# EAGLE design base (EAGLE 9.6.2)

## Sheet 1 of 4
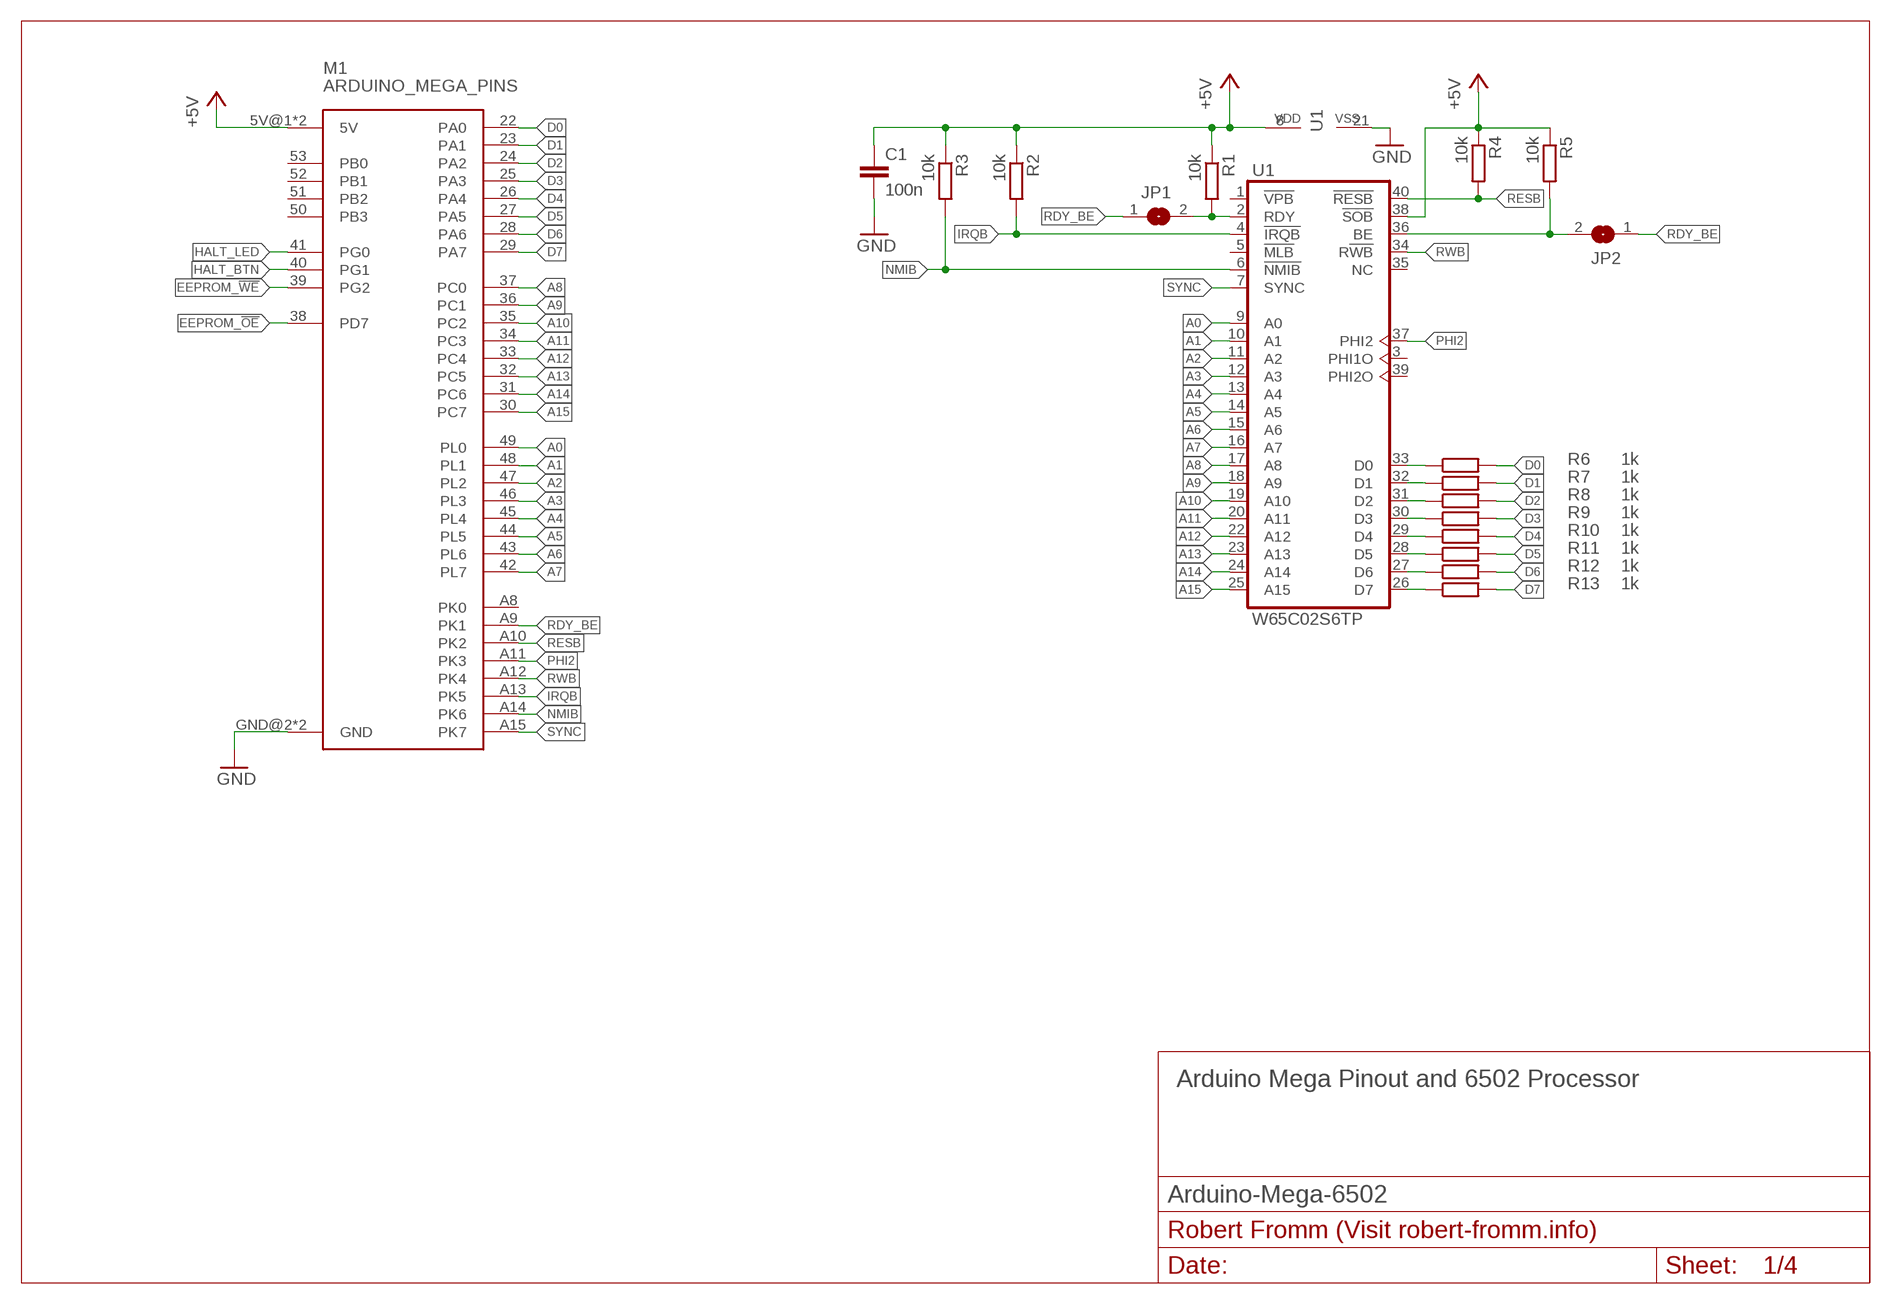
[diagram p0: schematic, sheet 1]

### Parts
C1  100n  C-EUC0805  [C0805]
JP1  SJ  [SJ]
JP2  SJ  [SJ]
M1  ARDUINO_MEGA_PINS  [ARDUINO_MEGA_PINS]
R1  10k  R-EU_R0805  [R0805]
R2  10k  R-EU_R0805  [R0805]
R3  10k  R-EU_R0805  [R0805]
R4  10k  R-EU_R0805  [R0805]
R5  10k  R-EU_R0805  [R0805]
R6  1k  R-EU_R0805  [R0805]
R7  1k  R-EU_R0805  [R0805]
R8  1k  R-EU_R0805  [R0805]
R9  1k  R-EU_R0805  [R0805]
R10  1k  R-EU_R0805  [R0805]
R11  1k  R-EU_R0805  [R0805]
R12  1k  R-EU_R0805  [R0805]
R13  1k  R-EU_R0805  [R0805]
U1  W65C02S6TP  [DIL40]

### Nets
+5V: C1.1 M1.5V@1(5V) M1.5V@2(5V) R1.1 R2.1 R3.1 R4.1 R5.1 U1.8(P:VDD) U1.38(1:!SOB) ; also sheet 2,3,4
A0: M1.49(PL0) U1.9(1:A0) ; also sheet 2,4
A1: M1.48(PL1) U1.10(1:A1) ; also sheet 2,4
A2: M1.47(PL2) U1.11(1:A2) ; also sheet 2,4
A3: M1.46(PL3) U1.12(1:A3) ; also sheet 2,4
A4: M1.45(PL4) U1.13(1:A4) ; also sheet 2,3,4
A5: M1.44(PL5) U1.14(1:A5) ; also sheet 2,3,4
A6: M1.43(PL6) U1.15(1:A6) ; also sheet 2,3,4
A7: M1.42(PL7) U1.16(1:A7) ; also sheet 2,4
A8: M1.37(PC0) U1.17(1:A8) ; also sheet 2,4
A9: M1.36(PC1) U1.18(1:A9) ; also sheet 2,4
A10: M1.35(PC2) U1.19(1:A10) ; also sheet 2,4
A11: M1.34(PC3) U1.20(1:A11) ; also sheet 2,4
A12: M1.33(PC4) U1.22(1:A12) ; also sheet 2,4
A13: M1.32(PC5) U1.23(1:A13) ; also sheet 2,4
A14: M1.31(PC6) U1.24(1:A14) ; also sheet 2,3,4
A15: M1.30(PC7) U1.25(1:A15) ; also sheet 3,4
BE: JP2.2 R5.2 U1.36(1:BE)
D0: M1.22(PA0) R6.2 ; also sheet 2,4
D1: M1.23(PA1) R7.2 ; also sheet 2,4
D2: M1.24(PA2) R8.2 ; also sheet 2,4
D3: M1.25(PA3) R9.2 ; also sheet 2,4
D4: M1.26(PA4) R10.2 ; also sheet 2,4
D5: M1.27(PA5) R11.2 ; also sheet 2,4
D6: M1.28(PA6) R12.2 ; also sheet 2,4
D7: M1.29(PA7) R13.2 ; also sheet 2,4
EEPROM_!OE: M1.38(PD7) ; also sheet 2
EEPROM_!WE: M1.39(PG2) ; also sheet 2
GND: C1.2 M1.GND@2(GND) M1.GND@3(GND) U1.21(P:VSS) ; also sheet 2,3,4
HALT_BTN: M1.40(PG1) ; also sheet 4
HALT_LED: M1.41(PG0) ; also sheet 4
IRQB: M1.A13(PK5) R2.2 U1.4(1:!IRQB) ; also sheet 2,4
N$1: R6.1 U1.33(1:D0)
N$2: R7.1 U1.32(1:D1)
N$3: R8.1 U1.31(1:D2)
N$4: R9.1 U1.30(1:D3)
N$5: R10.1 U1.29(1:D4)
N$6: R11.1 U1.28(1:D5)
N$7: R12.1 U1.27(1:D6)
N$8: R13.1 U1.26(1:D7)
NMIB: M1.A14(PK6) R3.2 U1.6(1:!NMIB)
PHI2: M1.A11(PK3) U1.37(1:PHI2) ; also sheet 2,3,4
RDY: JP1.2 R1.2 U1.2(1:RDY)
RDY_BE: JP1.1 JP2.1 M1.A9(PK1)
RESB: M1.A10(PK2) R4.2 U1.40(1:!RESB) ; also sheet 2,4
RWB: M1.A12(PK4) U1.34(1:R!WB) ; also sheet 2,4
SYNC: M1.A15(PK7) U1.7(1:SYNC) ; also sheet 4
Unconnected: M1.50(PB3) M1.51(PB2) M1.52(PB1) M1.53(PB0) M1.A8(PK0) U1.1(1:!VPB) U1.3(1:PHI1O) U1.5(1:!MLB) U1.35(1:NC) U1.39(1:PHI2O)

### Notes on the sheet
- Arduino Mega Pinout and 6502 Processor

## Sheet 2 of 4
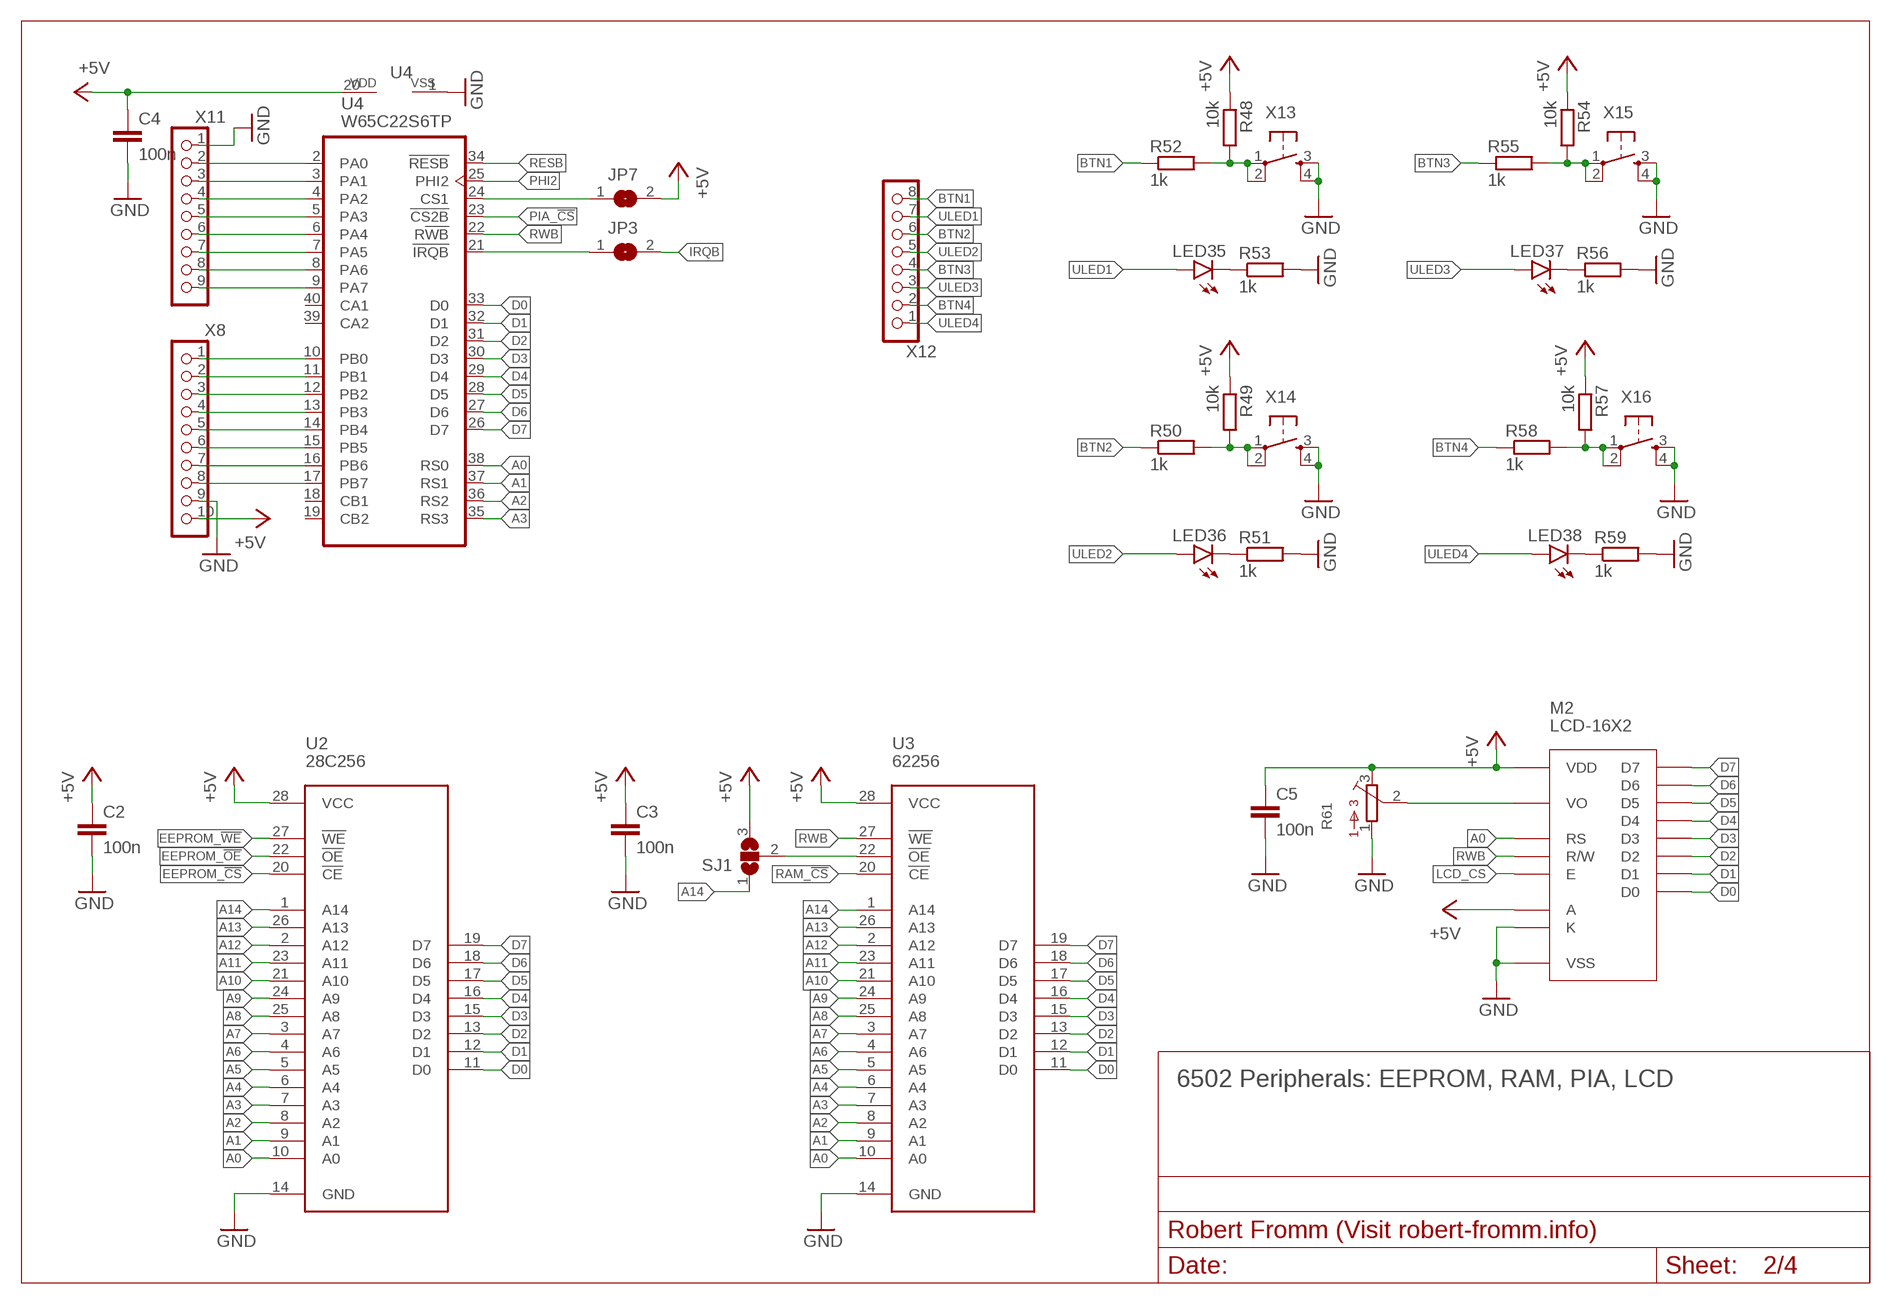
[diagram p1: schematic, sheet 2]

### Parts
C2  100n  C-EUC0805  [C0805]
C3  100n  C-EUC0805  [C0805]
C4  100n  C-EUC0805  [C0805]
C5  100n  C-EUC0805  [C0805]
JP3  SJ  [SJ]
JP7  SJ  [SJ]
LED35  LEDSML0805  [SML0805]
LED36  LEDSML0805  [SML0805]
LED37  LEDSML0805  [SML0805]
LED38  LEDSML0805  [SML0805]
M2  LCD-16X2  [LCD-16X2]
R48  10k  R-EU_R0805  [R0805]
R49  10k  R-EU_R0805  [R0805]
R50  1k  R-EU_R0805  [R0805]
R51  1k  R-EU_R0805  [R0805]
R52  1k  R-EU_R0805  [R0805]
R53  1k  R-EU_R0805  [R0805]
R54  10k  R-EU_R0805  [R0805]
R55  1k  R-EU_R0805  [R0805]
R56  1k  R-EU_R0805  [R0805]
R57  10k  R-EU_R0805  [R0805]
R58  1k  R-EU_R0805  [R0805]
R59  1k  R-EU_R0805  [R0805]
R61  3362P  [3362P]
SJ1  SJ2W  [SJ_2]
U2  28C256  [DIL28-6]
U3  62256  [DIL28-6]
U4  W65C22S6TP  [DIL40]
X8  PINHD_10_RND  [1X10]
X11  PINHD_9_RND  [1X09]
X12  PINHD_8_RND  [1X08]
X13  TACT_SWITCH  [TACTILE_SWITCH_PTH_6.0MM]
X14  TACT_SWITCH  [TACTILE_SWITCH_PTH_6.0MM]
X15  TACT_SWITCH  [TACTILE_SWITCH_PTH_6.0MM]
X16  TACT_SWITCH  [TACTILE_SWITCH_PTH_6.0MM]

### Nets
+5V: C2.1 C3.1 C4.1 C5.1 JP7.2 M2.2(VDD) M2.15(A) R48.1 R49.1 R54.1 R57.1 R61.3 SJ1.3 U2.28(VCC) U3.28(VCC) U4.20(VIAP:VDD) X8.10 ; also sheet 1,3,4
A0: M2.4(RS) U2.10(A0) U3.10(A0) U4.38(VIA:RS0) ; also sheet 1,4
A1: U2.9(A1) U3.9(A1) U4.37(VIA:RS1) ; also sheet 1,4
A2: U2.8(A2) U3.8(A2) U4.36(VIA:RS2) ; also sheet 1,4
A3: U2.7(A3) U3.7(A3) U4.35(VIA:RS3) ; also sheet 1,4
A4: U2.6(A4) U3.6(A4) ; also sheet 1,3,4
A5: U2.5(A5) U3.5(A5) ; also sheet 1,3,4
A6: U2.4(A6) U3.4(A6) ; also sheet 1,3,4
A7: U2.3(A7) U3.3(A7) ; also sheet 1,4
A8: U2.25(A8) U3.25(A8) ; also sheet 1,4
A9: U2.24(A9) U3.24(A9) ; also sheet 1,4
A10: U2.21(A10) U3.21(A10) ; also sheet 1,4
A11: U2.23(A11) U3.23(A11) ; also sheet 1,4
A12: U2.2(A12) U3.2(A12) ; also sheet 1,4
A13: U2.26(A13) U3.26(A13) ; also sheet 1,4
A14: SJ1.1 U2.1(A14) U3.1(A14) ; also sheet 1,3,4
BTN1: R52.1 X12.8
BTN2: R50.1 X12.6
BTN3: R55.1 X12.4
BTN4: R58.1 X12.2
D0: M2.7(D0) U2.11(D0) U3.11(D0) U4.33(VIA:D0) ; also sheet 1,4
D1: M2.8(D1) U2.12(D1) U3.12(D1) U4.32(VIA:D1) ; also sheet 1,4
D2: M2.9(D2) U2.13(D2) U3.13(D2) U4.31(VIA:D2) ; also sheet 1,4
D3: M2.10(D3) U2.15(D3) U3.15(D3) U4.30(VIA:D3) ; also sheet 1,4
D4: M2.11(D4) U2.16(D4) U3.16(D4) U4.29(VIA:D4) ; also sheet 1,4
D5: M2.12(D5) U2.17(D5) U3.17(D5) U4.28(VIA:D5) ; also sheet 1,4
D6: M2.13(D6) U2.18(D6) U3.18(D6) U4.27(VIA:D6) ; also sheet 1,4
D7: M2.14(D7) U2.19(D7) U3.19(D7) U4.26(VIA:D7) ; also sheet 1,4
EEPROM_!CS: U2.20(!CE) ; also sheet 3
EEPROM_!OE: U2.22(!OE) ; also sheet 1
EEPROM_!WE: U2.27(!WE) ; also sheet 1
GND: C2.2 C3.2 C4.2 C5.2 M2.1(VSS) M2.16(K) R51.2 R53.2 R56.2 R59.2 R61.1 U2.14(GND) U3.14(GND) U4.1(VIAP:VSS) X8.9 X11.1 X13.3 X13.4 X14.3 X14.4 X15.3 X15.4 X16.3 X16.4 ; also sheet 1,3,4
IRQB: JP3.2 ; also sheet 1,4
LCD_CS: M2.6(E) ; also sheet 3
N$11: SJ1.2 U3.22(!OE)
N$55: JP3.1 U4.21(VIA:!IRQB)
N$68: U4.2(VIA:PA0) X11.2
N$69: U4.3(VIA:PA1) X11.3
N$70: U4.4(VIA:PA2) X11.4
N$71: U4.5(VIA:PA3) X11.5
N$72: U4.6(VIA:PA4) X11.6
N$73: U4.7(VIA:PA5) X11.7
N$74: U4.8(VIA:PA6) X11.8
N$75: U4.9(VIA:PA7) X11.9
N$76: U4.10(VIA:PB0) X8.1
N$77: U4.11(VIA:PB1) X8.2
N$78: U4.12(VIA:PB2) X8.3
N$79: U4.13(VIA:PB3) X8.4
N$80: U4.14(VIA:PB4) X8.5
N$81: U4.15(VIA:PB5) X8.6
N$82: U4.16(VIA:PB6) X8.7
N$83: U4.17(VIA:PB7) X8.8
N$84: R48.2 R52.2 X13.1 X13.2
N$85: LED35.C R53.1
N$86: R49.2 R50.2 X14.1 X14.2
N$87: LED36.C R51.1
N$88: R54.2 R55.2 X15.1 X15.2
N$89: LED37.C R56.1
N$90: R57.2 R58.2 X16.1 X16.2
N$91: JP7.1 U4.24(VIA:CS1)
N$92: M2.3(VO) R61.2
N$95: LED38.C R59.1
PHI2: U4.25(VIA:PHI2) ; also sheet 1,3,4
PIA_!CS: U4.23(VIA:!CS2B) ; also sheet 3
RAM_!CS: U3.20(!CE) ; also sheet 3
RESB: U4.34(VIA:!RESB) ; also sheet 1,4
RWB: M2.5(R/W) U3.27(!WE) U4.22(VIA:R!WB) ; also sheet 1,4
ULED1: LED35.A X12.7
ULED2: LED36.A X12.5
ULED3: LED37.A X12.3
ULED4: LED38.A X12.1
Unconnected: U4.18(VIA:CB1) U4.19(VIA:CB2) U4.39(VIA:CA2) U4.40(VIA:CA1)

### Notes on the sheet
- 6502 Peripherals: EEPROM, RAM, PIA, LCD

## Sheet 3 of 4
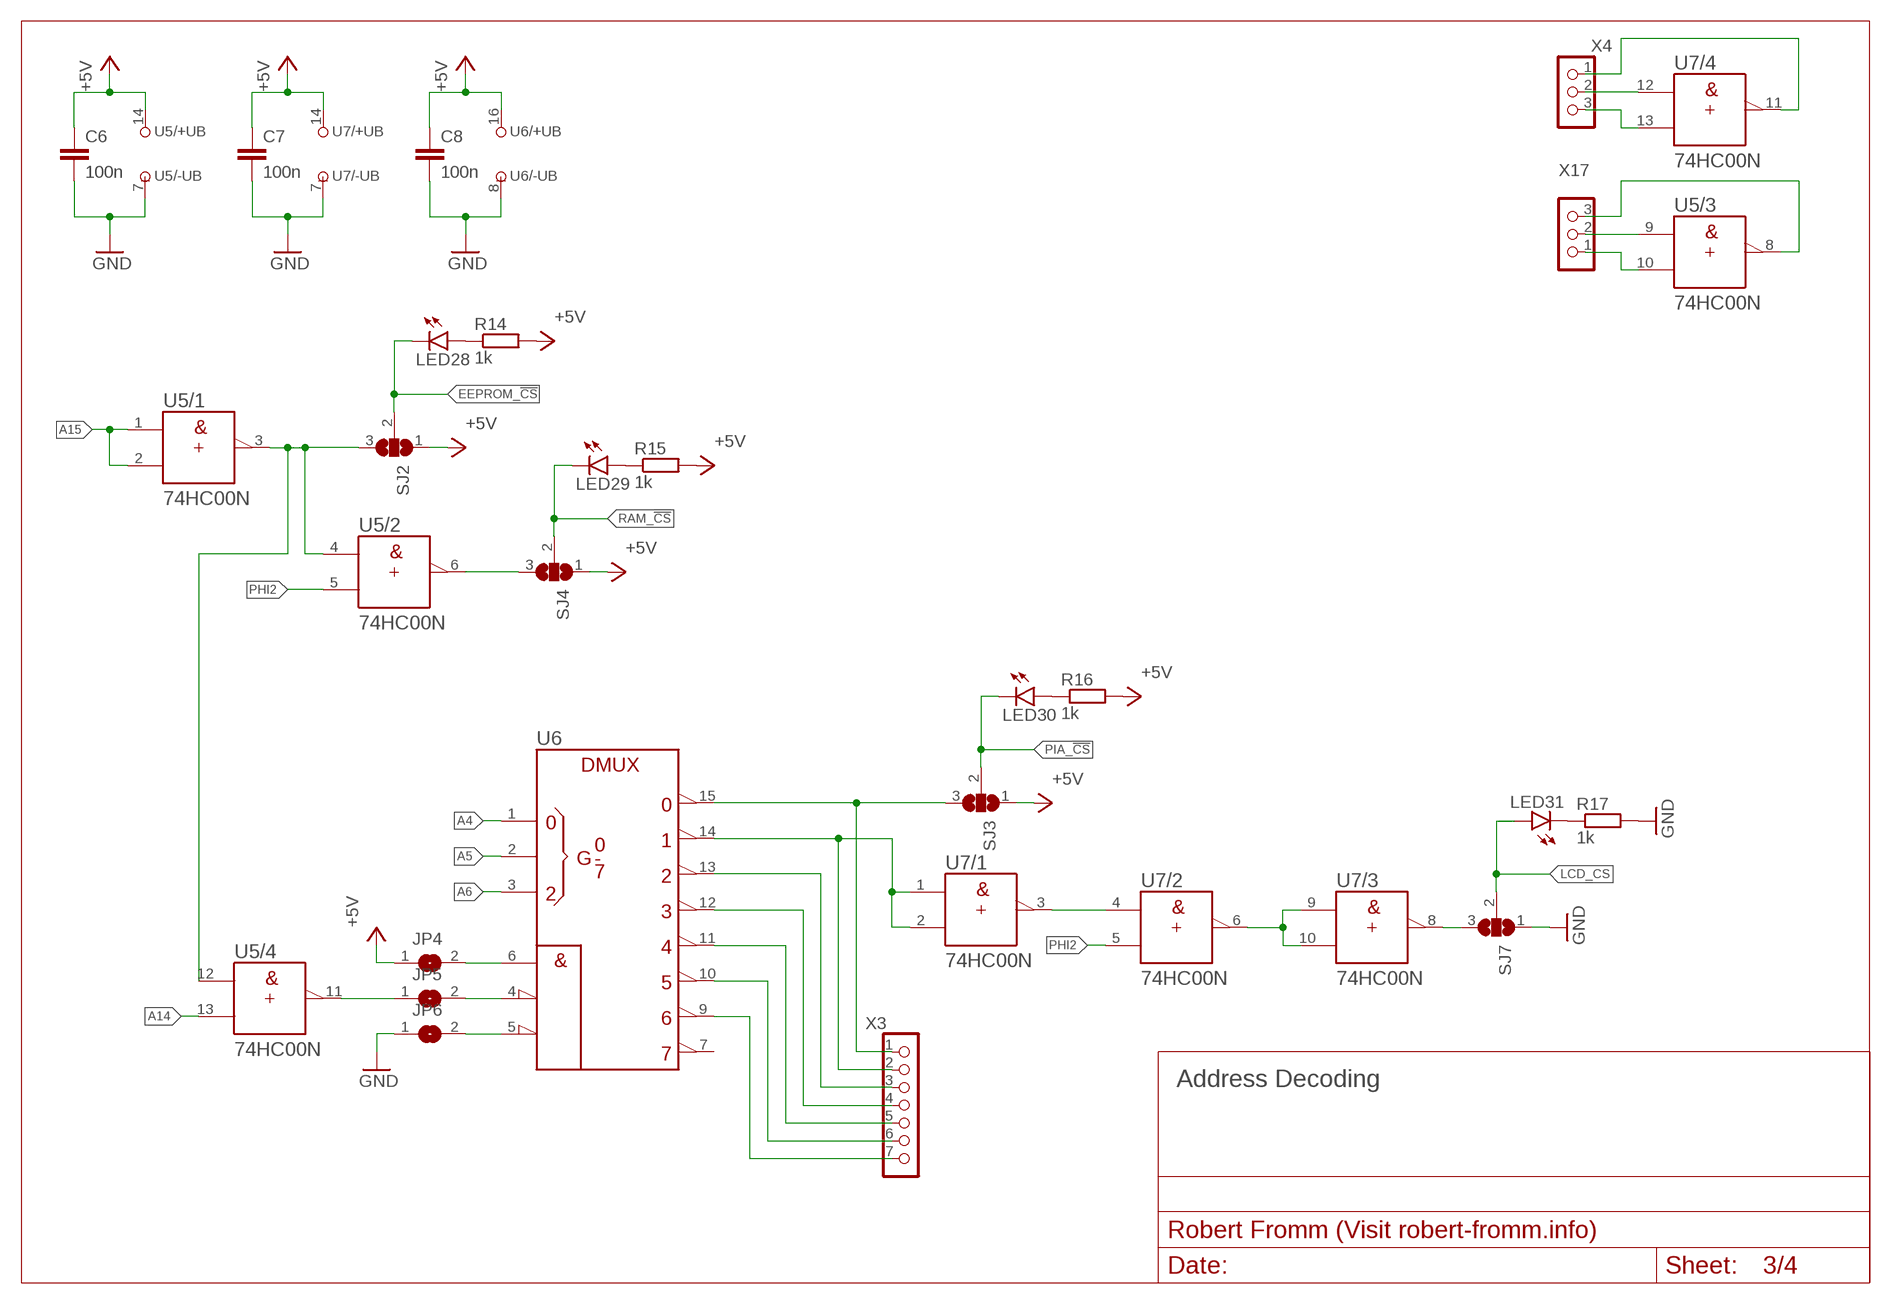
[diagram p2: schematic, sheet 3]

### Parts
C6  100n  C-EUC0805  [C0805]
C7  100n  C-EUC0805  [C0805]
C8  100n  C-EUC0805  [C0805]
JP4  SJ  [SJ]
JP5  SJ  [SJ]
JP6  SJ  [SJ]
LED28  LEDSML0805  [SML0805]
LED29  LEDSML0805  [SML0805]
LED30  LEDSML0805  [SML0805]
LED31  LEDSML0805  [SML0805]
R14  1k  R-EU_R0805  [R0805]
R15  1k  R-EU_R0805  [R0805]
R16  1k  R-EU_R0805  [R0805]
R17  1k  R-EU_R0805  [R0805]
SJ2  SJ2W  [SJ_2]
SJ3  SJ2W  [SJ_2]
SJ4  SJ2W  [SJ_2]
SJ7  SJ2W  [SJ_2]
U5  74HC00N  [DIL14]
U6  74138N  [DIL16]
U7  74HC00N  [DIL14]
X3  PINHD_7_RND  [1X07]
X4  PINHD_3_RND  [1X03]
X17  PINHD_3_RND  [1X03]

### Nets
+5V: C6.1 C7.1 C8.1 JP4.1 R14.2 R15.2 R16.2 SJ2.1 SJ3.1 SJ4.1 U5.14(/+UB:+UB) U6.16(+UB) U7.14(/+UB:+UB) ; also sheet 1,2,4
A4: U6.1(A) ; also sheet 1,2,4
A5: U6.2(B) ; also sheet 1,2,4
A6: U6.3(C) ; also sheet 1,2,4
A14: U5.13(/4:B) ; also sheet 1,2,4
A15: U5.1(/1:A) U5.2(/1:B) ; also sheet 1,4
EEPROM_!CS: LED28.C SJ2.2 ; also sheet 2
GND: C6.2 C7.2 C8.2 JP6.1 R17.2 SJ7.1 U5.7(/-UB:-UB) U6.8(-UB) U7.7(/-UB:-UB) ; also sheet 1,2,4
LCD_CS: LED31.A SJ7.2 ; also sheet 2
N$9: U5.8(/3:Y) X17.3
N$10: U5.9(/3:A) X17.2
N$12: SJ2.3 U5.3(/1:Y) U5.4(/2:A) U5.12(/4:A)
N$13: SJ4.3 U5.6(/2:Y)
N$14: SJ3.3 U6.15(Y0) X3.1
N$15: JP4.2 U6.6(G1)
N$16: JP5.1 U5.11(/4:Y)
N$17: JP6.2 U6.5(!G2B)
N$18: U6.14(Y1) U7.1(/1:A) U7.2(/1:B) X3.2
N$19: U7.3(/1:Y) U7.4(/2:A)
N$20: U7.6(/2:Y) U7.9(/3:A) U7.10(/3:B)
N$21: SJ7.3 U7.8(/3:Y)
N$49: LED28.A R14.1
N$50: LED29.A R15.1
N$51: LED30.A R16.1
N$52: U5.10(/3:B) X17.1
N$53: JP5.2 U6.4(!G2A)
N$56: U6.12(Y3) X3.4
N$57: U6.11(Y4) X3.5
N$58: U6.13(Y2) X3.3
N$59: U6.10(Y5) X3.6
N$60: U6.9(Y6) X3.7
N$61: LED31.C R17.1
N$62: U7.11(/4:Y) X4.1
N$63: U7.12(/4:A) X4.2
N$64: U7.13(/4:B) X4.3
PHI2: U5.5(/2:B) U7.5(/2:B) ; also sheet 1,2,4
PIA_!CS: LED30.C SJ3.2 ; also sheet 2
RAM_!CS: LED29.C SJ4.2 ; also sheet 2
Unconnected: U6.7(Y7)

### Notes on the sheet
- Address Decoding

## Sheet 4 of 4
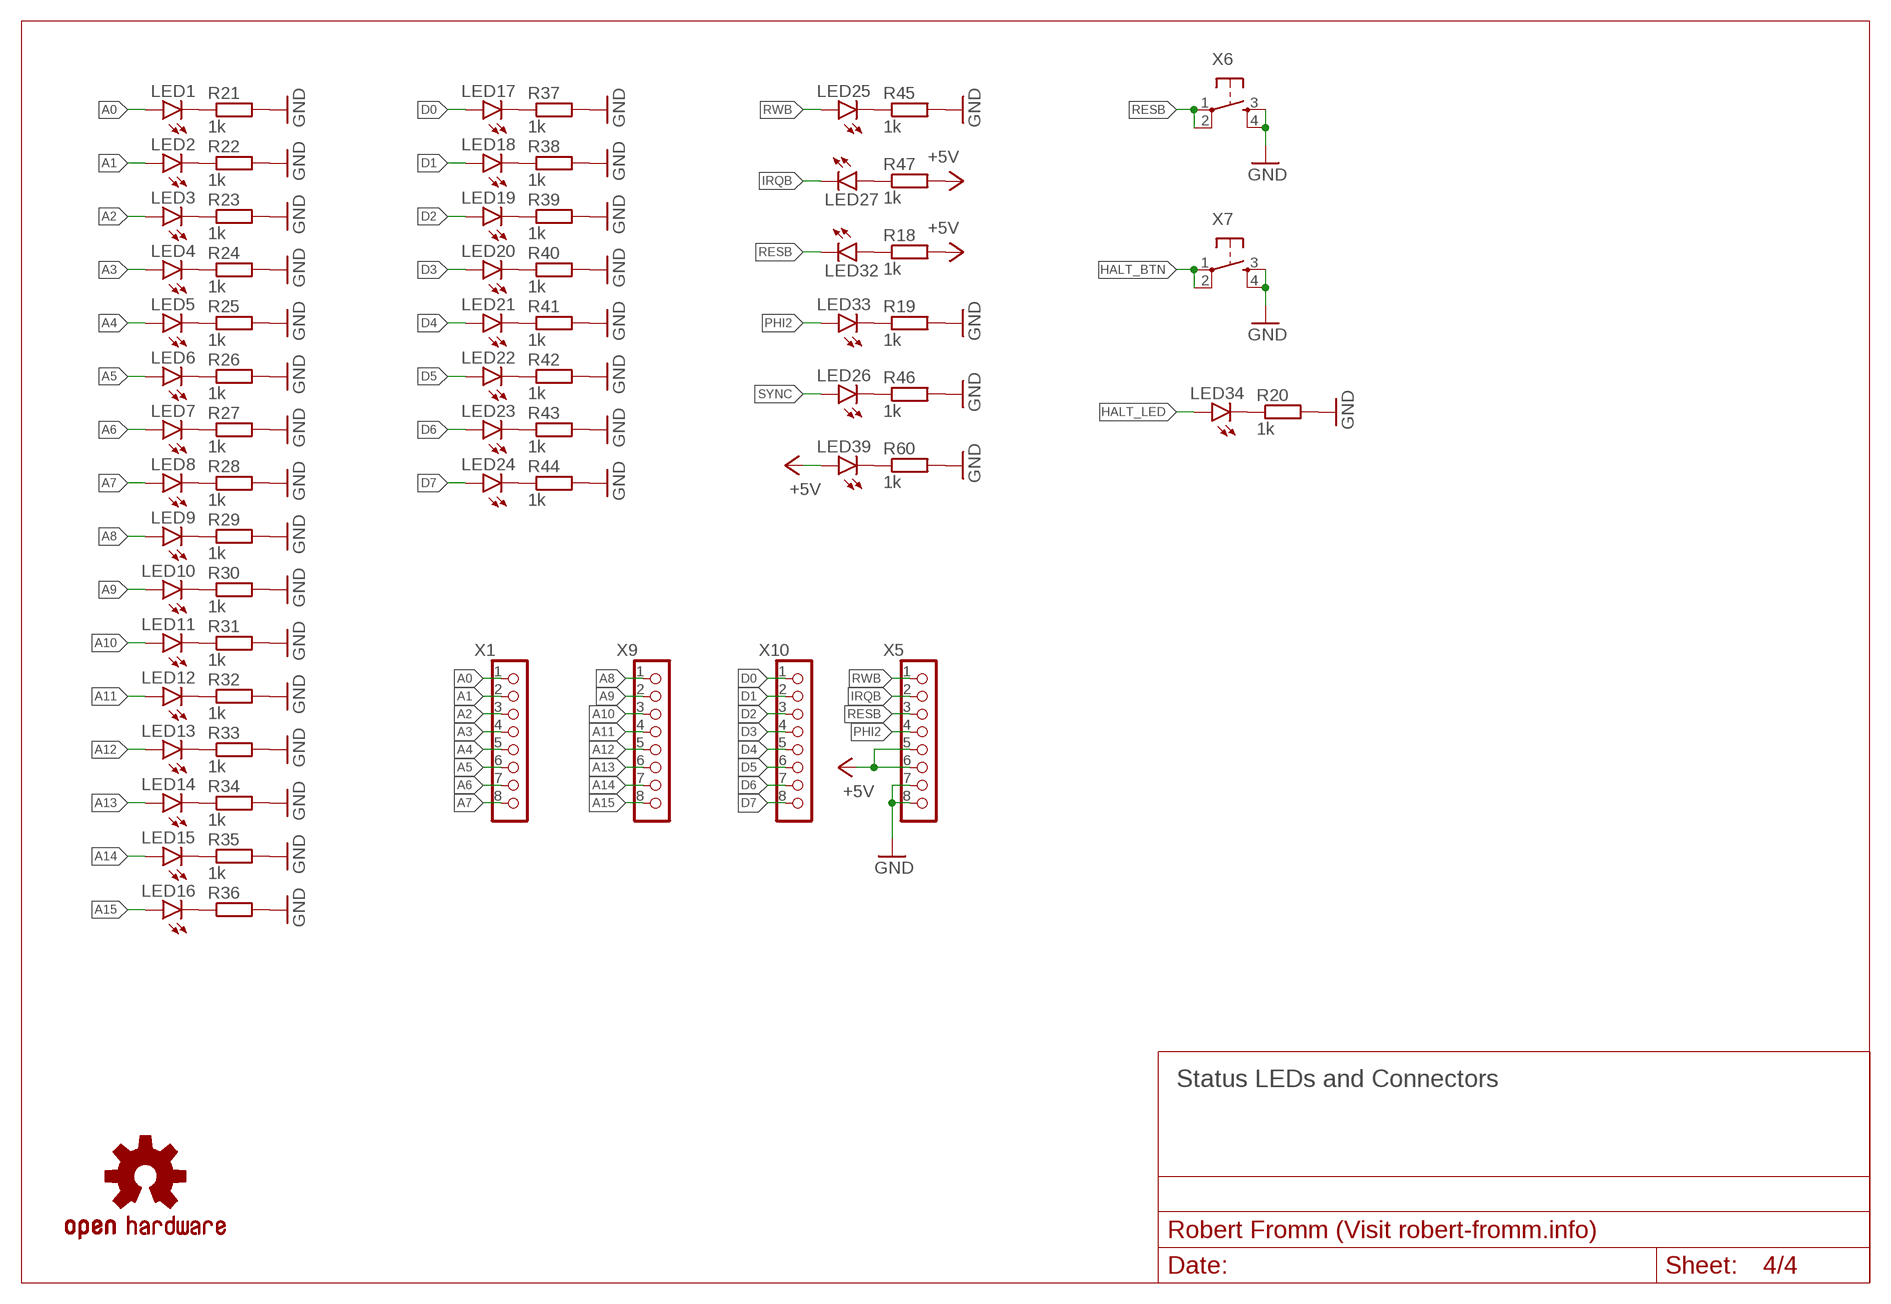
[diagram p3: schematic, sheet 4]

### Parts
LED1  LEDSML0805  [SML0805]
LED2  LEDSML0805  [SML0805]
LED3  LEDSML0805  [SML0805]
LED4  LEDSML0805  [SML0805]
LED5  LEDSML0805  [SML0805]
LED6  LEDSML0805  [SML0805]
LED7  LEDSML0805  [SML0805]
LED8  LEDSML0805  [SML0805]
LED9  LEDSML0805  [SML0805]
LED10  LEDSML0805  [SML0805]
LED11  LEDSML0805  [SML0805]
LED12  LEDSML0805  [SML0805]
LED13  LEDSML0805  [SML0805]
LED14  LEDSML0805  [SML0805]
LED15  LEDSML0805  [SML0805]
LED16  LEDSML0805  [SML0805]
LED17  LEDSML0805  [SML0805]
LED18  LEDSML0805  [SML0805]
LED19  LEDSML0805  [SML0805]
LED20  LEDSML0805  [SML0805]
LED21  LEDSML0805  [SML0805]
LED22  LEDSML0805  [SML0805]
LED23  LEDSML0805  [SML0805]
LED24  LEDSML0805  [SML0805]
LED25  LEDSML0805  [SML0805]
LED26  LEDSML0805  [SML0805]
LED27  LEDSML0805  [SML0805]
LED32  LEDSML0805  [SML0805]
LED33  LEDSML0805  [SML0805]
LED34  LEDSML0805  [SML0805]
LED39  LEDSML0805  [SML0805]
LOGO1  OSHW-LOGOM  [OSHW-LOGO-M]
R18  1k  R-EU_R0805  [R0805]
R19  1k  R-EU_R0805  [R0805]
R20  1k  R-EU_R0805  [R0805]
R21  1k  R-EU_R0805  [R0805]
R22  1k  R-EU_R0805  [R0805]
R23  1k  R-EU_R0805  [R0805]
R24  1k  R-EU_R0805  [R0805]
R25  1k  R-EU_R0805  [R0805]
R26  1k  R-EU_R0805  [R0805]
R27  1k  R-EU_R0805  [R0805]
R28  1k  R-EU_R0805  [R0805]
R29  1k  R-EU_R0805  [R0805]
R30  1k  R-EU_R0805  [R0805]
R31  1k  R-EU_R0805  [R0805]
R32  1k  R-EU_R0805  [R0805]
R33  1k  R-EU_R0805  [R0805]
R34  1k  R-EU_R0805  [R0805]
R35  1k  R-EU_R0805  [R0805]
R36  1k  R-EU_R0805  [R0805]
R37  1k  R-EU_R0805  [R0805]
R38  1k  R-EU_R0805  [R0805]
R39  1k  R-EU_R0805  [R0805]
R40  1k  R-EU_R0805  [R0805]
R41  1k  R-EU_R0805  [R0805]
R42  1k  R-EU_R0805  [R0805]
R43  1k  R-EU_R0805  [R0805]
R44  1k  R-EU_R0805  [R0805]
R45  1k  R-EU_R0805  [R0805]
R46  1k  R-EU_R0805  [R0805]
R47  1k  R-EU_R0805  [R0805]
R60  1k  R-EU_R0805  [R0805]
X1  PINHD_8_RND  [1X08]
X5  PINHD_8_RND  [1X08]
X6  TACT_SWITCH  [TACTILE_SWITCH_PTH_6.0MM]
X7  TACT_SWITCH  [TACTILE_SWITCH_PTH_6.0MM]
X9  PINHD_8_RND  [1X08]
X10  PINHD_8_RND  [1X08]

### Nets
+5V: LED39.A R18.2 R47.2 X5.5 X5.6 ; also sheet 1,2,3
A0: LED1.A X1.1 ; also sheet 1,2
A1: LED2.A X1.2 ; also sheet 1,2
A2: LED3.A X1.3 ; also sheet 1,2
A3: LED4.A X1.4 ; also sheet 1,2
A4: LED5.A X1.5 ; also sheet 1,2,3
A5: LED6.A X1.6 ; also sheet 1,2,3
A6: LED7.A X1.7 ; also sheet 1,2,3
A7: LED8.A X1.8 ; also sheet 1,2
A8: LED9.A X9.1 ; also sheet 1,2
A9: LED10.A X9.2 ; also sheet 1,2
A10: LED11.A X9.3 ; also sheet 1,2
A11: LED12.A X9.4 ; also sheet 1,2
A12: LED13.A X9.5 ; also sheet 1,2
A13: LED14.A X9.6 ; also sheet 1,2
A14: LED15.A X9.7 ; also sheet 1,2,3
A15: LED16.A X9.8 ; also sheet 1,3
D0: LED17.A X10.1 ; also sheet 1,2
D1: LED18.A X10.2 ; also sheet 1,2
D2: LED19.A X10.3 ; also sheet 1,2
D3: LED20.A X10.4 ; also sheet 1,2
D4: LED21.A X10.5 ; also sheet 1,2
D5: LED22.A X10.6 ; also sheet 1,2
D6: LED23.A X10.7 ; also sheet 1,2
D7: LED24.A X10.8 ; also sheet 1,2
GND: R19.2 R20.2 R21.2 R22.2 R23.2 R24.2 R25.2 R26.2 R27.2 R28.2 R29.2 R30.2 R31.2 R32.2 R33.2 R34.2 R35.2 R36.2 R37.2 R38.2 R39.2 R40.2 R41.2 R42.2 R43.2 R44.2 R45.2 R46.2 R60.2 X5.7 X5.8 X6.3 X6.4 X7.3 X7.4 ; also sheet 1,2,3
HALT_BTN: X7.1 X7.2 ; also sheet 1
HALT_LED: LED34.A ; also sheet 1
IRQB: LED27.C X5.2 ; also sheet 1,2
N$22: LED1.C R21.1
N$23: LED2.C R22.1
N$24: LED3.C R23.1
N$25: LED4.C R24.1
N$26: LED5.C R25.1
N$27: LED6.C R26.1
N$28: LED7.C R27.1
N$29: LED8.C R28.1
N$30: LED9.C R29.1
N$31: LED10.C R30.1
N$32: LED11.C R31.1
N$33: LED12.C R32.1
N$34: LED13.C R33.1
N$35: LED14.C R34.1
N$36: LED15.C R35.1
N$37: LED16.C R36.1
N$38: LED17.C R37.1
N$39: LED18.C R38.1
N$40: LED19.C R39.1
N$41: LED20.C R40.1
N$42: LED21.C R41.1
N$43: LED22.C R42.1
N$44: LED23.C R43.1
N$45: LED24.C R44.1
N$46: LED25.C R45.1
N$47: LED26.C R46.1
N$48: LED27.A R47.1
N$54: LED39.C R60.1
N$65: LED32.A R18.1
N$66: LED33.C R19.1
N$67: LED34.C R20.1
PHI2: LED33.A X5.4 ; also sheet 1,2,3
RESB: LED32.C X5.3 X6.1 X6.2 ; also sheet 1,2
RWB: LED25.A X5.1 ; also sheet 1,2
SYNC: LED26.A ; also sheet 1

### Notes on the sheet
- Status LEDs and Connectors

## Library data of the parts
C1-C8 = rcl:C-EU: CAPACITOR, European symbol; SPICEPREFIX: C
JP1-JP7 = 6502_lib:SJ: SMD solder JUMPER
LED1-LED39 = led:LED: LED OSRAM: - CHIPLED LG R971, LG N971, LY N971, LG Q971, LY Q971, LO R971, LY R971 LH N974, LH R974 LS Q976, LO Q976, LY Q976 LO Q996 - Hyper CHIPLED LW Q18S LB Q993, LB Q99A, LB R99A - SideLED LS A670, LO A670, LY A670, LG A670, LP A670 LB A673, LV A673, LT A673, LW A673 LH A674 LY A675 LS A676, LA A676, LO A676, LY A676, LW A676 LS A679, LY A679, LG A679 - Hyper Micro SIDELED® LS Y876, LA Y876, LO Y876, LY Y876 LT Y87S - SmartLED LW L88C, LW L88S LB L89C, LB L89S, LG L890 LS L89K, LO L89K, LY L89K LS L896, LA L896, LO L896, LY L896 - TOPLED LS T670, LO T670, LY T670, LG T670, LP T670 LSG T670, LSP T670, LSY T670, LOP T670, LYG T670 LG T671, LOG T671, LSG T671 LB T673, LV T673, LT T673, LW T673 LH T674 LS T676, LA T676, LO T676, LY T676, LB T676, LH T676, LSB T676, LW T676 LB T67C, LV T67C, LT T67C, LS T67K, LO T67K, LY T67K, LW E67C LS E67B, LA E67B, LO E67B, LY E67B, LB E67C, LV E67C, LT E67C LW T67C LS T679, LY T679, LG T679 LS T770, LO T770, LY T770, LG T770, LP T770 LB T773, LV T773, LT T773, LW T773 LH T774 LS E675, LA E675, LY E675, LS T675 LS T776, LA T776, LO T776, LY T776, LB T776 LHGB T686 LT T68C, LB T68C - Hyper Mini TOPLED® LB M676 - Mini TOPLED Santana® LG M470 LS M47K, LO M47K, LY M47K Source: http://www.osram.convergy.de LUXEON: - LUMILED® LXK2-PW12-R00, LXK2-PW12-S00, LXK2-PW14-U00, LXK2-PW14-V00 LXK2-PM12-R00, LXK2-PM12-S00, LXK2-PM14-U00 LXK2-PE12-Q00, LXK2-PE12-R00, LXK2-PE12-S00, LXK2-PE14-T00, LXK2-PE14-U00 LXK2-PB12-K00, LXK2-PB12-L00, LXK2-PB12-M00, LXK2-PB14-N00, LXK2-PB14-P00, LXK2-PB14-Q00 LXK2-PR12-L00, LXK2-PR12-M00, LXK2-PR14-Q00, LXK2-PR14-R00 LXK2-PD12-Q00, LXK2-PD12-R00, LXK2-PD12-S00 LXK2-PH12-R00, LXK2-PH12-S00 LXK2-PL12-P00, LXK2-PL12-Q00, LXK2-PL12-R00 Source: www.luxeon.com KINGBRIGHT: KA-3528ASYC Source: www.kingbright.com
LOGO1 = SparkFun-Aesthetics:OSHW-LOGO: Open-Source Hardware (OSHW) Logo This logo indicates the piece of hardware it is found on incorporates a OSHW license and/or adheres to the definition of open source hardware found here: http://freedomdefined.org/OSHW
M1 = 6502_lib:ARDUINO_MEGA_PINS
M2 = 6502_lib:LCD-16X2
R1-R60 = rcl:R-EU_: RESISTOR, European symbol; SPICEPREFIX: R
R61 = 6502_lib:3362: 3362 Series 1/4" Square Trimmer
SJ1-SJ4 SJ7 = 6502_lib:SJ2W: SMD solder JUMPER
U1 = 6502_lib:W65C02S: W65C02 by WDC
U2 = 6502_lib:28C256
U3 = 6502_lib:62256
U4 = 6502_lib:W65C22S: W65C22 by WDC
U5 U7 = 6502_lib:74*00: Quad 2-input NAND gate
U6 = 6502_lib:74*138: 3-line to 8-line DECODER/DEMULTIPLEXER
X1 X5 X9 X10 X12 = 6502_lib:PINHD_8_RND: PIN HEADER
X3 = 6502_lib:PINHD_7_RND: PIN HEADER
X4 X17 = 6502_lib:PINHD_3_RND
X6 X7 X13-X16 = 6502_lib:TACT_SWITCH
X8 = 6502_lib:PINHD_10_RND: PIN HEADER
X11 = 6502_lib:PINHD_9_RND: PIN HEADER

## Board
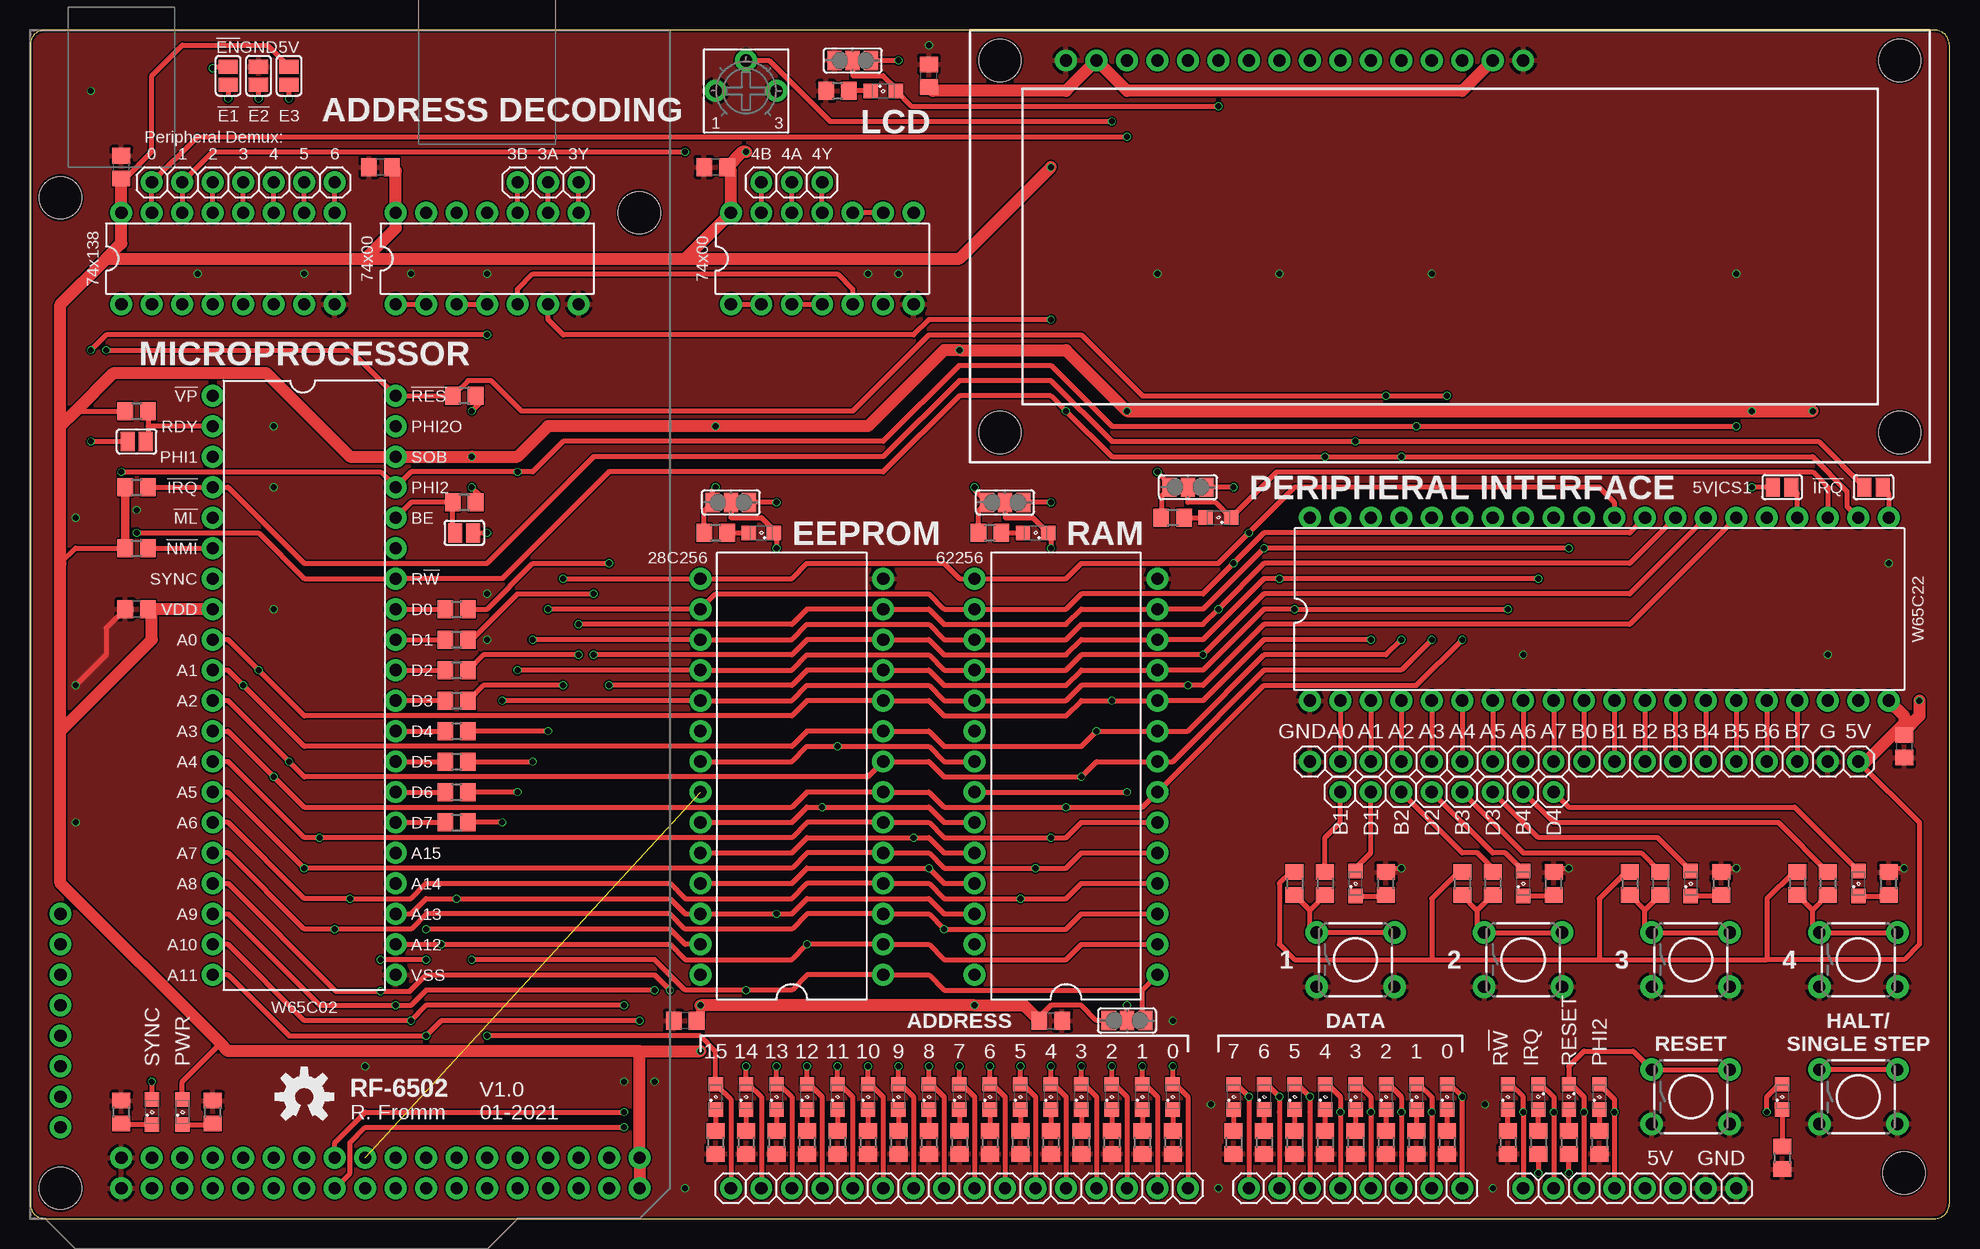
[diagram p4: board, top side]
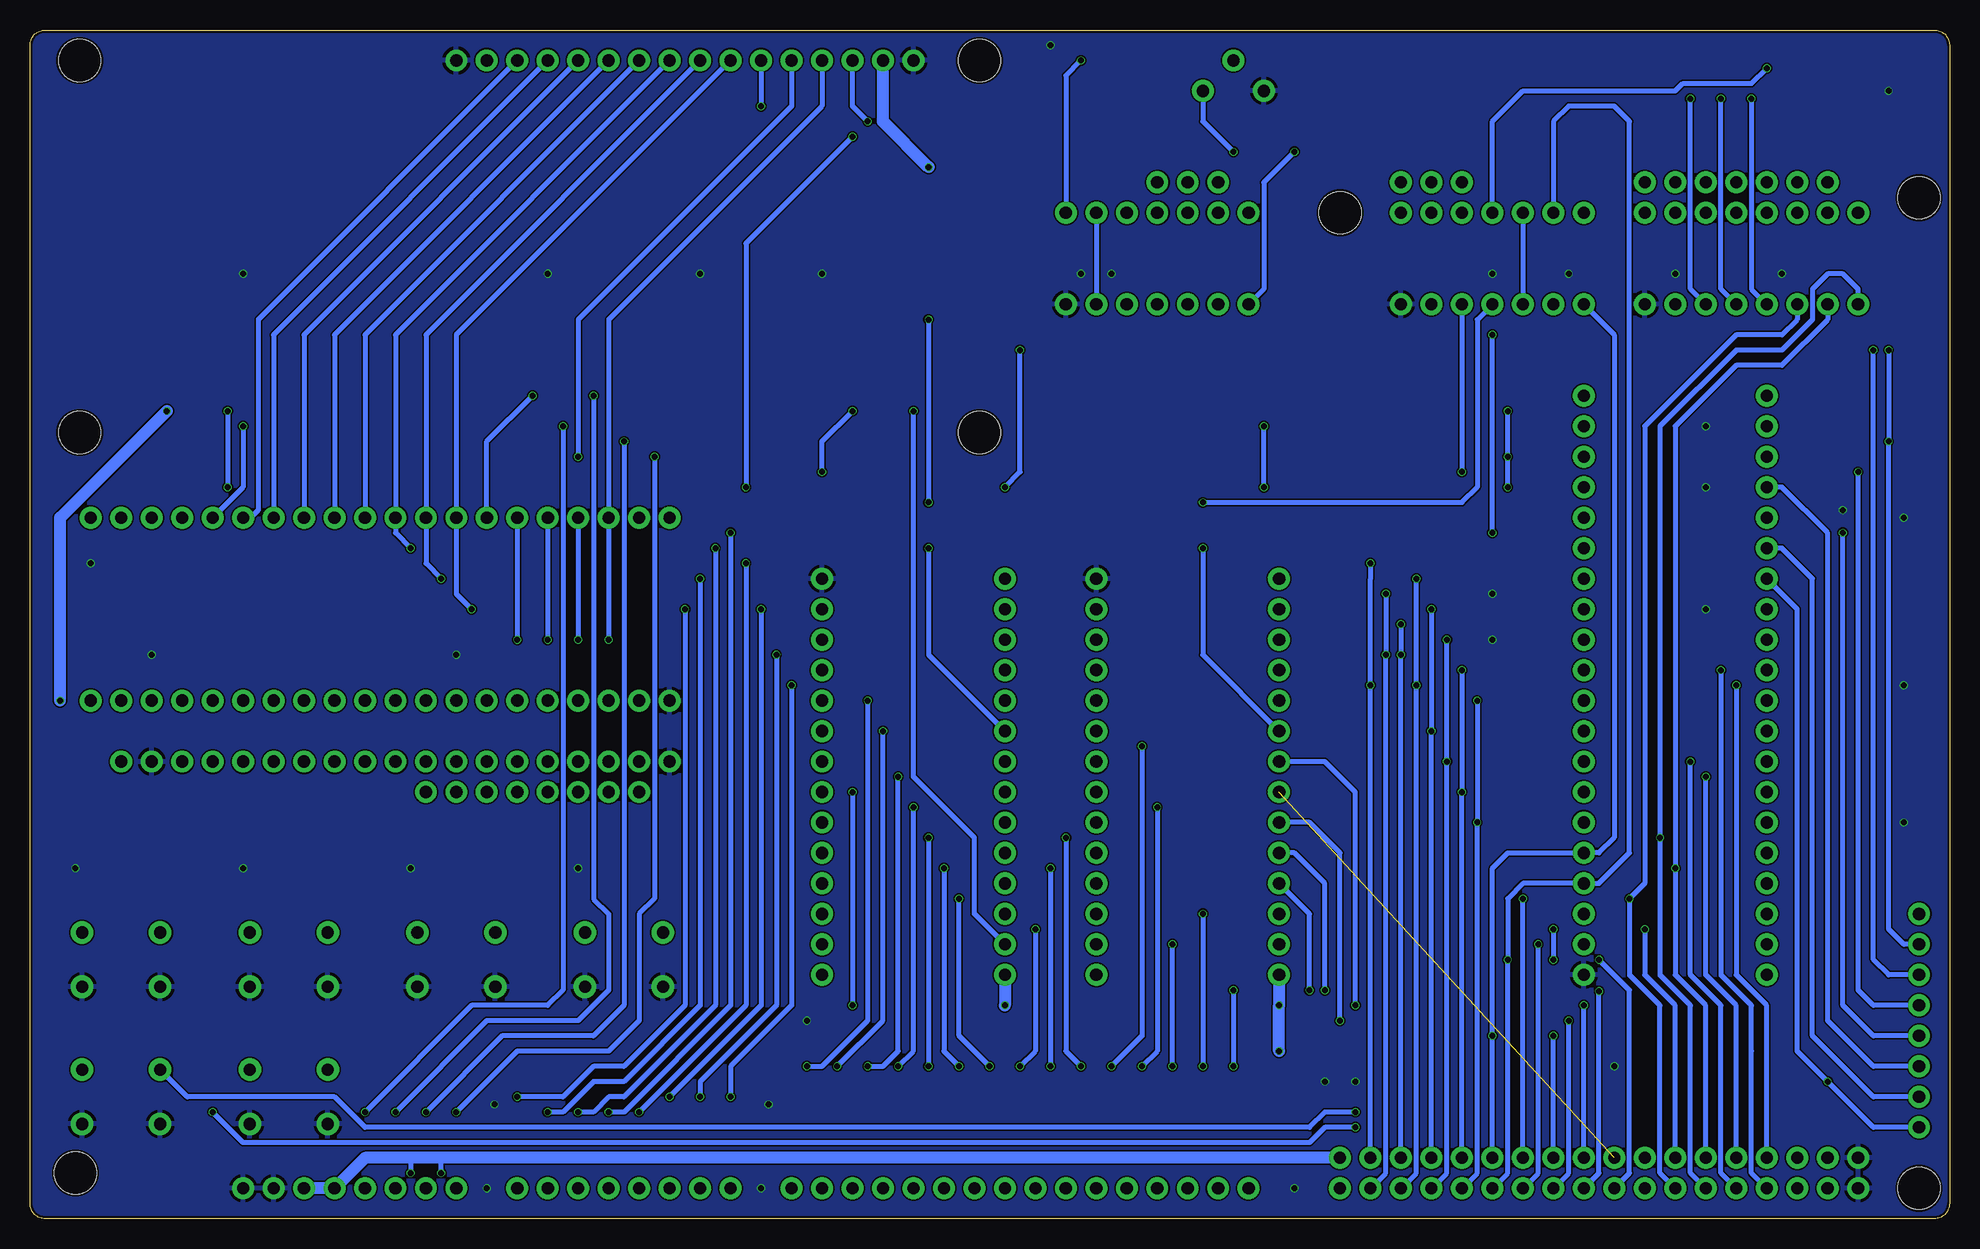
[diagram p5: board, bottom side, seen from below]

Size 160 x 99.06 mm. Coordinates in mm from the lower left corner, seen from the top.
Outline: 160,1.27 160,97.79 arc90 158.73,99.06 1.27,99.06 arc90 0,97.79 0,1.27 arc90 1.27,0 158.73,0 arc90 160,1.27
Copper layers (1*16): Top 0.035mm / dielectric 1.6mm / Bottom 0.035mm
Design rules "jlcpcb-2layers *": minimum track width 5mil, minimum drill 0.3mm, track to track 5mil, track to pad 5mil, pad to pad 5mil, via to via 5mil, smd to smd 5mil, copper to edge 0.2mm, drill to drill 6mil, minimum pad ring 10mil, minimum via ring 3mil, stop-mask expansion 4mil, vias tented up to drill 0.5mm, thermal gap 10mil
Holes 3.5 mm at 156.21,3.81

### Footprints (pad centres in the part's own frame; a part is rotated, then mirrored left to right if it is on the bottom)
C0805 = smd 1.3 x 1.5: 1 -0.95,0; 2 0.95,0
SJ = smd 1.168 x 1.6: 1 -0.762,0; 2 0.762,0
SML0805 = smd 1.2 x 1.2: A 1.05,0; C -1.05,0
ARDUINO_MEGA_PINS = drill 1.016 pad 1.778: 5V@1 44.45,24.13; 5V@2 46.99,24.13; 22 44.45,21.59; 23 46.99,21.59; 24 44.45,19.05; 25 46.99,19.05; 26 44.45,16.51; 27 46.99,16.51; 28 44.45,13.97; 29 46.99,13.97; 30 44.45,11.43; 31 46.99,11.43; 32 44.45,8.89; 33 46.99,8.89; 34 44.45,6.35; 35 46.99,6.35; 36 44.45,3.81; 37 46.99,3.81; 38 44.45,1.27; 39 46.99,1.27; 40 44.45,-1.27; 41 46.99,-1.27; 42 44.45,-3.81; 43 46.99,-3.81; 44 44.45,-6.35; 45 46.99,-6.35; 46 44.45,-8.89; 47 46.99,-8.89; 48 44.45,-11.43; 49 46.99,-11.43; 50 44.45,-13.97; 51 46.99,-13.97; 52 44.45,-16.51; 53 46.99,-16.51; A8 24.13,-24.13; A9 26.67,-24.13; A10 29.21,-24.13; A11 31.75,-24.13; A12 34.29,-24.13; A13 36.83,-24.13; A14 39.37,-24.13; A15 41.91,-24.13; GND@2 44.45,-19.05; GND@3 46.99,-19.05 | hole 3.5: -34.29,24.13; -35.56,-24.13; 46.99,-24.13
LCD-16X2 = drill 1.016 pad 1.778: 1 0,0; 2 2.54,0; 3 5.08,0; 4 7.62,0; 5 10.16,0; 6 12.7,0; 7 15.24,0; 8 17.78,0; 9 20.32,0; 10 22.86,0; 11 25.4,0; 12 27.94,0; 13 30.48,0; 14 33.02,0; 15 35.56,0; 16 38.1,0 | hole 3.5: -5.5,0; -5.5,-31; 69.5,0; 69.5,-31
R0805 = smd 1.3 x 1.5: 1 -0.95,0; 2 0.95,0
3362P = drill 1.016 pad 1.778: 1 -2.54,0; 2 0,2.54; 3 2.54,0
SJ_2 = smd 1.168 x 1.6: 1 -1.524,0; 2 0,0; 3 1.524,0
DIL40 = drill 1.016 pad 1.778: 1 -24.13,-7.62; 2 -21.59,-7.62; 3 -19.05,-7.62; 4 -16.51,-7.62; 5 -13.97,-7.62; 6 -11.43,-7.62; 7 -8.89,-7.62; 8 -6.35,-7.62; 9 -3.81,-7.62; 10 -1.27,-7.62; 11 1.27,-7.62; 12 3.81,-7.62; 13 6.35,-7.62; 14 8.89,-7.62; 15 11.43,-7.62; 16 13.97,-7.62; 17 16.51,-7.62; 18 19.05,-7.62; 19 21.59,-7.62; 20 24.13,-7.62; 21 24.13,7.62; 22 21.59,7.62; 23 19.05,7.62; 24 16.51,7.62; 25 13.97,7.62; 26 11.43,7.62; 27 8.89,7.62; 28 6.35,7.62; 29 3.81,7.62; 30 1.27,7.62; 31 -1.27,7.62; 32 -3.81,7.62; 33 -6.35,7.62; 34 -8.89,7.62; 35 -11.43,7.62; 36 -13.97,7.62; 37 -16.51,7.62; 38 -19.05,7.62; 39 -21.59,7.62; 40 -24.13,7.62
DIL28-6 = drill 1.016 pad 1.778: 1 -16.51,-7.62; 2 -13.97,-7.62; 3 -11.43,-7.62; 4 -8.89,-7.62; 5 -6.35,-7.62; 6 -3.81,-7.62; 7 -1.27,-7.62; 8 1.27,-7.62; 9 3.81,-7.62; 10 6.35,-7.62; 11 8.89,-7.62; 12 11.43,-7.62; 13 13.97,-7.62; 14 16.51,-7.62; 15 16.51,7.62; 16 13.97,7.62; 17 11.43,7.62; 18 8.89,7.62; 19 6.35,7.62; 20 3.81,7.62; 21 1.27,7.62; 22 -1.27,7.62; 23 -3.81,7.62; 24 -6.35,7.62; 25 -8.89,7.62; 26 -11.43,7.62; 27 -13.97,7.62; 28 -16.51,7.62
DIL14 = drill 1.016 pad 1.778: 1 -7.62,-3.81; 2 -5.08,-3.81; 3 -2.54,-3.81; 4 0,-3.81; 5 2.54,-3.81; 6 5.08,-3.81; 7 7.62,-3.81; 8 7.62,3.81; 9 5.08,3.81; 10 2.54,3.81; 11 0,3.81; 12 -2.54,3.81; 13 -5.08,3.81; 14 -7.62,3.81
DIL16 = drill 1.016 pad 1.778: 1 -8.89,-3.81; 2 -6.35,-3.81; 3 -3.81,-3.81; 4 -1.27,-3.81; 5 1.27,-3.81; 6 3.81,-3.81; 7 6.35,-3.81; 8 8.89,-3.81; 9 8.89,3.81; 10 6.35,3.81; 11 3.81,3.81; 12 1.27,3.81; 13 -1.27,3.81; 14 -3.81,3.81; 15 -6.35,3.81; 16 -8.89,3.81
1X08 = drill 1.016 pad 1.778: 1 -8.89,0; 2 -6.35,0; 3 -3.81,0; 4 -1.27,0; 5 1.27,0; 6 3.81,0; 7 6.35,0; 8 8.89,0
1X07 = drill 1.016 pad 1.778: 1 -7.62,0; 2 -5.08,0; 3 -2.54,0; 4 0,0; 5 2.54,0; 6 5.08,0; 7 7.62,0
1X03 = drill 1.016 pad 1.778: 1 -2.54,0; 2 0,0; 3 2.54,0
TACTILE_SWITCH_PTH_6.0MM = drill 1.016 pad 1.88: 1 -3.251,2.261; 2 3.251,2.261; 3 -3.251,-2.261; 4 3.251,-2.261
1X10 = drill 1.016 pad 1.778: 1 -11.43,0; 2 -8.89,0; 3 -6.35,0; 4 -3.81,0; 5 -1.27,0; 6 1.27,0; 7 3.81,0; 8 6.35,0; 9 8.89,0; 10 11.43,0
1X09 = drill 1.016 pad 1.778: 1 -10.16,0; 2 -7.62,0; 3 -5.08,0; 4 -2.54,0; 5 0,0; 6 2.54,0; 7 5.08,0; 8 7.62,0; 9 10.16,0

### Placement (x,y rotation side)
C1  8.89,50.8 180 top
C2  54.61,16.51 180 top
C3  85.09,16.51 0 top
C4  156.21,39.37 270 top
C5  74.93,95.25 90 top
C6  29.21,87.63 180 top
C7  57.15,87.63 180 top
C8  7.62,87.63 90 top
JP1  8.89,64.77 0 top
JP2  36.2,57.15 180 top
JP3  153.67,60.96 180 top
JP4  21.59,95.25 270 top
JP5  16.51,95.25 270 top
JP6  19.05,95.25 270 top
JP7  146.05,60.96 180 top
LED1  95.25,10.16 90 top
LED2  92.71,10.16 90 top
LED3  90.17,10.16 90 top
LED4  87.63,10.16 90 top
LED5  85.09,10.16 90 top
LED6  82.55,10.16 90 top
LED7  80.01,10.16 90 top
LED8  77.47,10.16 90 top
LED9  74.93,10.16 90 top
LED10  72.39,10.16 90 top
LED11  69.85,10.16 90 top
LED12  67.31,10.16 90 top
LED13  64.77,10.16 90 top
LED14  62.23,10.16 90 top
LED15  59.69,10.16 90 top
LED16  57.15,10.16 90 top
LED17  118.11,10.16 90 top
LED18  115.57,10.16 90 top
LED19  113.03,10.16 90 top
LED20  110.49,10.16 90 top
LED21  107.95,10.16 90 top
LED22  105.41,10.16 90 top
LED23  102.87,10.16 90 top
LED24  100.33,10.16 90 top
LED25  123.19,10.16 90 top
LED26  10.16,8.89 90 top
LED27  125.73,10.16 270 top
LED28  60.96,57.15 180 top
LED29  83.82,57.15 180 top
LED30  99.06,58.42 180 top
LED31  71.12,93.98 0 top
LED32  128.27,10.16 270 top
LED33  130.81,10.16 90 top
LED34  146.05,10.16 90 top
LED35  110.49,27.94 90 top
LED36  124.46,27.94 90 top
LED37  138.43,27.94 90 top
LED38  152.4,27.94 90 top
LED39  12.7,8.89 90 top
LOGO1  22.86,10.16 0 top
M1  26.67,49.53 270 top
M2  86.36,96.52 0 top
R1  8.89,67.31 0 top
R2  8.89,60.96 0 top
R3  8.89,55.88 0 top
R4  36.2,68.58 180 top
R5  36.2,59.69 180 top
R6  35.56,50.8 0 top
R7  35.56,48.26 0 top
R8  35.56,45.72 0 top
R9  35.56,43.18 0 top
R10  35.56,40.64 0 top
R11  35.56,38.1 0 top
R12  35.56,35.56 0 top
R13  35.56,33.02 0 top
R14  57.15,57.15 180 top
R15  80.01,57.15 180 top
R16  95.25,58.42 180 top
R17  67.31,93.98 180 top
R18  128.27,6.35 270 top
R19  130.81,6.35 270 top
R20  146.05,5.08 270 top
R21  95.25,6.35 270 top
R22  92.71,6.35 270 top
R23  90.17,6.35 270 top
R24  87.63,6.35 270 top
R25  85.09,6.35 270 top
R26  82.55,6.35 270 top
R27  80.01,6.35 270 top
R28  77.47,6.35 270 top
R29  74.93,6.35 270 top
R30  72.39,6.35 270 top
R31  69.85,6.35 270 top
R32  67.31,6.35 270 top
R33  64.77,6.35 270 top
R34  62.23,6.35 270 top
R35  59.69,6.35 270 top
R36  57.15,6.35 270 top
R37  118.11,6.35 270 top
R38  115.57,6.35 270 top
R39  113.03,6.35 270 top
R40  110.49,6.35 270 top
R41  107.95,6.35 270 top
R42  105.41,6.35 270 top
R43  102.87,6.35 270 top
R44  100.33,6.35 270 top
R45  123.19,6.35 270 top
R46  7.62,8.89 90 top
R47  125.73,6.35 270 top
R48  105.41,27.94 270 top
R49  119.38,27.94 270 top
R50  121.92,27.94 270 top
R51  127,27.94 90 top
R52  107.95,27.94 270 top
R53  113.03,27.94 90 top
R54  133.35,27.94 270 top
R55  135.89,27.94 270 top
R56  140.97,27.94 90 top
R57  147.32,27.94 270 top
R58  149.86,27.94 270 top
R59  154.94,27.94 90 top
R60  15.24,8.89 90 top
R61  59.69,93.98 0 top
SJ1  91.44,16.51 180 top
SJ2  58.42,59.69 0 top
SJ3  96.52,60.96 0 top
SJ4  81.28,59.69 0 top
SJ7  68.58,96.52 0 top
U1  22.86,44.45 270 top
U2  63.5,36.83 90 top
U3  86.36,36.83 90 top
U4  130.81,50.8 0 top
U5  38.1,80.01 0 top
U6  16.51,80.01 0 top
U7  66.04,80.01 0 top
X1  87.63,2.54 180 top
X3  17.78,86.36 0 top
X4  63.5,86.36 180 top
X5  133.35,2.54 0 top
X6  138.43,10.16 0 top
X7  152.4,10.16 0 top
X8  140.97,38.1 0 top
X9  67.31,2.54 180 top
X10  110.49,2.54 180 top
X11  116.84,38.1 0 top
X12  118.11,35.56 180 top
X13  110.49,21.59 0 top
X14  124.46,21.59 0 top
X15  138.43,21.59 0 top
X16  152.4,21.59 0 top
X17  43.18,86.36 0 top

### Tracks (layer width: path | path; a pad name or v marks a point on that pad's centre or on a via)
+5V  (via drill 0.5)
  Top 0.4: C3.1 84.14,16.83 85.09,17.78 87.63,17.78 88.9,16.51 SJ1.3 | R14.2 56.2,58.99 SJ2.1 56.9,60.71 v57.15,60.96 | R15.2 79.06,58.99 SJ4.1 78.74,60.71 v78.74,60.96 | v93.98,62.23 95,61.21 SJ3.1 94.3,60.26 R16.2 | 2.54,54.61 3.81,55.88 R3.1 | 3.81,67.31 R1.1 | C8.1 7.94,86.68 10.16,88.9 10.16,95.25 12.7,97.79 19.81,97.79 JP4.1 | v36.83,67.31 37.47,67.94 37.47,68.26 | v36.83,60.96 37.47,60.33 37.47,60.01 R5.1 | R47.2 v125.73,3.81 | v128.27,3.81 R18.2 | R48.1 105.09,28.89 104.14,27.94 104.14,22.86 105.41,21.59 116.84,21.59 | 116.84,21.59 130.81,21.59 | R49.1 119.06,28.89 116.84,26.67 116.84,21.59 | R54.1 133.03,28.89 130.81,26.67 130.81,21.59 | R57.1 147,28.89 144.78,26.67 144.78,21.59 | 130.81,21.59 144.78,21.59 | X8.10 157.48,33.02 157.48,22.86 156.21,21.59 144.78,21.59 | LED39.A 12.7,11.43 15.88,14.61 | JP7.2 v143.53,60.96
  Top 0.7: R4.1 37.47,68.26 | 10.16,50.48 C1.1 | R3.1 R2.1 | 30.48,87.31 C6.1 | 75.25,93.98 C5.1 | 156.21,41.27 156.21,40.64 C4.1 | 58.42,87.31 C7.1 | v55.88,17.78 55.88,16.83 C2.1
  Top 1: M2.15 119.38,93.98 91.44,93.98 M2.2 86.36,93.98 75.25,93.98 | v55.88,17.78 v78.74,17.78 82.87,17.78 C3.1 | 2.54,40.64 2.54,27.94 15.88,14.61 16.51,13.97 50.8,13.97 | 2.54,40.64 10.16,48.26 10.16,50.48 | U1.8 C1.1 | 2.54,40.64 2.54,54.61 2.54,66.04 | 2.54,66.04 3.81,67.31 6.99,70.48 19.68,70.48 26.67,63.5 U1.38 v36.83,63.5 40.64,63.5 43.18,66.04 v57.15,66.04 69.85,66.04 76.2,72.39 v77.47,72.39 86.36,72.39 v91.44,67.31 v143.51,67.31 v148.59,67.31 | 2.54,66.04 2.54,76.2 6.35,80.01 | 6.35,80.01 7.62,81.28 U6.16 C8.1 | 6.35,80.01 27.94,80.01 | 27.94,80.01 30.48,82.55 U5.14 30.48,87.31 | 27.94,80.01 54.61,80.01 | 54.61,80.01 U7.14 58.42,87.31 | v157.48,43.18 157.48,41.91 156.21,40.64 | U4.20 156.21,41.91 C4.1 | C7.1 59.37,88.9 v59.69,88.9 | 156.21,41.27 153.03,38.1 X8.10 | M1.5V@2 M1.5V@1 50.8,13.97 | v85.09,87.63 77.47,80.01 54.61,80.01 | 50.8,13.97 v55.88,13.97
  Bottom 0.4: v78.74,60.96 77.47,62.23 v77.47,72.39 | v93.98,62.23 93.98,64.77 v91.44,67.31 | v57.15,60.96 v57.15,66.04 | v36.83,60.96 v36.83,63.5 v36.83,67.31 | v125.73,3.81 125.73,5.08 | 128.27,5.08 v128.27,3.81 | R61.3 62.23,91.44 v59.69,88.9 | v143.51,67.31 143.53,67.29 v143.53,60.96
  Bottom 0.7: M1.5V@1 125.73,5.08 128.27,5.08 132.08,5.08
  Bottom 1: v157.48,43.18 157.48,58.42 v148.59,67.31 | U2.28 v55.88,17.78 v55.88,13.97 | U3.28 v78.74,17.78 | v85.09,87.63 88.9,91.44 M2.2 | X5.6 X5.5 132.08,5.08 M1.5V@1
A0  (via drill 0.5)
  Top 0.4: U1.9 16.51,48.26 v19.05,45.72 22.86,41.91 63.5,41.91 64.77,43.18 U2.10 74.93,43.18 76.2,41.91 86.36,41.91 87.63,43.18 v90.17,43.18 U3.10 97.79,43.18 102.87,48.26 v111.76,48.26 | v95.25,12.7 LED1.A 95.47,11.21 96.52,10.16 X1.1
  Bottom 0.4: v111.76,48.26 U4.38 111.76,74.93 93.98,92.71 M2.4 | v95.25,12.7 93.98,12.7 90.17,16.51 v90.17,43.18 | M1.49 16.51,3.81 16.51,13.97 16.51,17.78 19.05,20.32 v19.05,45.72
A1  (via drill 0.5)
  Top 0.4: U1.10 16.51,45.72 v17.78,44.45 22.86,39.37 63.5,39.37 64.77,40.64 U2.9 74.93,40.64 76.2,39.37 87.63,39.37 v88.9,40.64 U3.9 96.52,40.64 102.87,46.99 113.03,46.99 v114.3,48.26 | v92.71,12.7 LED2.A 92.93,11.21 93.98,10.16 X1.2
  Bottom 0.4: U4.37 v114.3,48.26 | v92.71,12.7 88.9,16.51 v88.9,40.64 | M1.48 15.24,17.78 17.78,20.32 v17.78,44.45
A2  (via drill 0.5)
  Top 0.4: U1.11 16.51,43.18 v21.59,38.1 22.86,36.83 69.85,36.83 U2.8 74.93,38.1 76.2,36.83 v87.63,36.83 88.9,38.1 U3.8 95.25,38.1 102.87,45.72 114.3,45.72 v116.84,48.26 | v90.17,12.7 LED3.A 90.39,11.21 91.44,10.16 X1.3
  Bottom 0.4: U4.36 v116.84,48.26 | v90.17,12.7 88.9,12.7 87.63,13.97 v87.63,36.83 | M1.47 19.05,3.81 19.05,17.78 21.59,20.32 v21.59,38.1
A3  (via drill 0.5)
  Top 0.4: U1.12 16.51,40.64 v20.32,36.83 22.86,34.29 63.5,34.29 64.77,35.56 U2.7 74.93,35.56 76.2,34.29 v86.36,34.29 92.71,34.29 U3.7 102.87,44.45 115.57,44.45 v119.38,48.26 | v87.63,12.7 LED4.A 87.85,11.21 88.9,10.16 X1.4
  Bottom 0.4: U4.35 v119.38,48.26 | v87.63,12.7 86.36,13.97 v86.36,34.29 | M1.46 17.78,17.78 20.32,20.32 v20.32,36.83
A4  (via drill 0.5)
  Top 0.4: U1.13 16.51,38.1 22.86,31.75 v24.13,31.75 63.5,31.75 64.77,33.02 U2.6 74.93,33.02 76.2,31.75 v85.09,31.75 86.36,31.75 87.63,33.02 U3.6 | v85.09,12.7 LED5.A 85.31,11.21 86.36,10.16 X1.5
  Bottom 0.4: v85.09,31.75 v85.09,12.7 | M1.45 21.59,3.81 21.59,17.78 24.13,20.32 v24.13,31.75 24.13,66.04 17.78,72.39 13.97,72.39 11.43,74.93 11.43,77.47 10.16,78.74 8.89,78.74 7.62,77.47 U6.1
A5  (via drill 0.5)
  Top 0.4: U1.14 16.51,35.56 v22.86,29.21 63.5,29.21 64.77,30.48 U2.5 74.93,30.48 76.2,29.21 v83.82,29.21 86.36,29.21 87.63,30.48 U3.5 | v82.55,12.7 LED6.A 82.77,11.21 83.82,10.16 X1.6
  Bottom 0.4: v83.82,29.21 83.82,13.97 v82.55,12.7 | M1.44 20.32,17.78 22.86,20.32 v22.86,29.21 22.86,66.04 17.78,71.12 13.97,71.12 10.16,74.93 U6.2
A6  (via drill 0.5)
  Top 0.4: U1.15 16.51,33.02 22.86,26.67 v26.67,26.67 31.75,26.67 33.02,27.94 53.34,27.94 54.61,26.67 63.5,26.67 64.77,27.94 U2.4 74.93,27.94 76.2,26.67 v82.55,26.67 86.36,26.67 87.63,27.94 U3.4 | v80.01,12.7 LED7.A 80.23,11.21 81.28,10.16 X1.7
  Bottom 0.4: v80.01,12.7 82.55,15.24 v82.55,26.67 | M1.43 24.13,3.81 24.13,17.78 26.67,20.32 v26.67,26.67 25.4,27.94 25.4,66.04 17.78,73.66 13.97,73.66 12.7,74.93 U6.3
A7  (via drill 0.5)
  Top 0.4: U1.16 16.51,30.48 22.86,24.13 v25.4,24.13 31.75,24.13 33.02,25.4 53.34,25.4 54.61,24.13 63.5,24.13 64.77,25.4 U2.3 74.93,25.4 v76.2,24.13 86.36,24.13 87.63,25.4 U3.3 | v77.47,12.7 LED8.A 77.69,11.21 78.74,10.16 X1.8
  Bottom 0.4: v77.47,12.7 76.2,13.97 v76.2,24.13 | M1.42 22.86,17.78 25.4,20.32 v25.4,24.13
A8  (via drill 0.5)
  Top 0.4: U1.17 16.51,27.94 25.5,18.95 v29.21,18.95 31.65,18.95 33.02,20.32 52.07,20.32 v53.34,19.05 | U2.25 63.5,27.94 64.77,29.21 v74.93,29.21 76.2,27.94 U3.25 | v74.93,12.7 LED9.A 75.15,11.21 76.2,10.16 X9.1
  Bottom 0.4: M1.37 29.21,3.81 v29.21,18.95 | v53.34,19.05 53.34,25.4 U2.25 | v74.93,29.21 v74.93,12.7
A9  (via drill 0.5)
  Top 0.4: v52.07,19.05 33.02,19.05 31.75,17.78 v30.48,17.78 24.13,17.78 16.51,25.4 U1.18 | U2.24 63.5,30.48 64.77,31.75 v73.66,31.75 74.93,31.75 76.2,30.48 U3.24 | v72.39,12.7 LED10.A 72.61,11.21 73.66,10.16 X9.2
  Bottom 0.4: M1.36 v30.48,17.78 | v52.07,19.05 52.07,27.94 54.61,30.48 U2.24 | v73.66,31.75 73.66,13.97 v72.39,12.7
A10  (via drill 0.5)
  Top 0.4: v49.53,17.78 33.02,17.78 v31.75,16.51 22.86,16.51 16.51,22.86 U1.19 | U2.21 63.5,38.1 64.77,39.37 v67.31,39.37 74.93,39.37 76.2,38.1 U3.21 | v69.85,12.7 LED11.A 70.07,11.21 71.12,10.16 X9.3
  Bottom 0.4: M1.35 31.75,3.81 v31.75,16.51 | v49.53,17.78 49.53,35.56 52.07,38.1 U2.21 | v69.85,12.7 67.31,15.24 v67.31,39.37
A11  (via drill 0.5)
  Top 0.4: U1.20 16.51,20.32 21.59,15.24 v33.02,15.24 34.29,16.51 v50.8,16.51 | U2.23 63.5,33.02 64.77,34.29 v66.04,34.29 74.93,34.29 76.2,33.02 U3.23 | v67.31,12.7 LED12.A 67.53,11.21 68.58,10.16 X9.4
  Bottom 0.4: M1.34 v33.02,15.24 | v50.8,16.51 50.8,30.48 53.34,33.02 U2.23 | v67.31,12.7 66.04,13.97 v66.04,34.29
A12  (via drill 0.5)
  Top 0.4: U3.2 87.63,22.86 86.36,21.59 76.2,21.59 74.93,22.86 U2.2 v64.77,22.86 63.5,21.59 54.61,21.59 53.34,22.86 v34.29,22.86 U1.22 | v64.77,12.7 LED13.A 64.99,11.21 66.04,10.16 X9.5
  Bottom 0.4: M1.33 34.29,3.81 v34.29,22.86 | v64.77,12.7 v64.77,22.86
A13  (via drill 0.5)
  Top 0.4: U3.26 76.2,25.4 74.93,26.67 64.77,26.67 63.5,25.4 v62.23,25.4 U2.26 54.61,25.4 53.34,26.67 v35.56,26.67 33.02,26.67 31.75,25.4 U1.23 | v62.23,12.7 LED14.A 62.45,11.21 63.5,10.16 X9.6
  Bottom 0.4: v62.23,25.4 v62.23,12.7 | M1.32 v35.56,26.67
A14  (via drill 0.5)
  Top 0.4: v36.83,21.59 52.07,21.59 54.61,19.05 v59.69,19.05 63.5,19.05 64.77,20.32 U2.1 74.93,20.32 76.2,19.05 92.71,19.05 | v59.69,12.7 LED15.A 59.91,11.21 60.96,10.16 X9.7 | 92.71,19.05 U3.1 | SJ1.1 92.71,16.76 92.71,19.05
  Bottom 0.4: M1.31 36.83,3.81 v36.83,21.59 36.83,26.67 35.56,27.94 U1.24 29.21,27.94 26.67,30.48 26.67,91.44 27.94,92.71 31.75,92.71 33.02,91.44 U5.13 | v59.69,19.05 v59.69,12.7
A15  (via drill 0.5)
  Top 0.4: X9.8 58.42,9.94 LED16.A 57.15,13.97 55.88,15.24 v38.1,15.24 | U5.1 U5.2
  Bottom 0.4: M1.30 v38.1,15.24 38.1,29.21 36.83,30.48 U1.25 29.21,30.48 27.94,31.75 27.94,73.66 U5.1
BE
  Top 0.4: U1.36 31.75,59.69 R5.2 35.24,57.34 JP2.2
BTN1
  Top 0.4: R52.1 107.95,31.75 109.22,33.02 X12.8
BTN2
  Top 0.4: R50.1 121.92,29.21 120.65,30.48 119.38,30.48 X12.6
BTN3
  Top 0.4: X12.4 124.46,30.48 134.3,30.48 R55.1
BTN4
  Top 0.4: X12.2 127,33.02 145.73,33.02 R58.1
D0  (via drill 0.5)
  Top 0.4: v48.26,44.45 63.5,44.45 64.77,45.72 U2.11 74.93,45.72 76.2,44.45 86.36,44.45 87.63,45.72 U3.11 97.79,45.72 102.87,50.8 v105.41,50.8 v123.19,50.8 | X10.1 v119.38,10.16 118.33,11.21 LED17.A | R6.2 38.1,50.8 41.91,54.61 v48.26,54.61
  Bottom 0.4: M1.22 v48.26,44.45 48.26,53.34 v48.26,54.61 | M2.7 124.46,73.66 U4.33 124.46,52.07 v123.19,50.8 | v119.38,10.16 115.57,10.16 113.03,12.7 110.49,12.7 105.41,17.78 v105.41,50.8
D1  (via drill 0.5)
  Top 0.4: v46.99,46.99 63.5,46.99 64.77,48.26 U2.12 74.93,48.26 76.2,46.99 86.36,46.99 87.63,48.26 U3.12 97.79,48.26 102.87,53.34 v104.14,53.34 v125.73,53.34 | v46.99,52.07 40.64,52.07 36.83,48.26 R7.2 | LED18.A 115.79,11.21 116.84,10.16 v116.84,8.89 X10.2
  Bottom 0.4: M1.23 46.99,3.81 v46.99,46.99 v46.99,52.07 | M2.8 127,73.66 U4.32 127,54.61 v125.73,53.34 | v116.84,8.89 115.57,8.89 113.03,11.43 110.49,11.43 104.14,17.78 v104.14,53.34
D2  (via drill 0.5)
  Top 0.4: v45.72,49.53 63.5,49.53 64.77,50.8 U2.13 74.93,50.8 76.2,49.53 86.36,49.53 87.63,50.8 U3.13 97.79,50.8 v102.87,55.88 v128.27,55.88 | R8.2 37.78,46.99 v45.72,46.99 | LED19.A 113.25,11.21 114.3,10.16 v114.3,8.89 X10.3
  Bottom 0.4: M1.24 v45.72,46.99 v45.72,49.53 | M2.9 129.54,73.66 U4.31 129.54,57.15 v128.27,55.88 | v102.87,55.88 102.87,17.78 110.49,10.16 111.76,10.16 113.03,8.89 v114.3,8.89
D3  (via drill 0.5)
  Top 0.4: v44.45,53.34 U2.15 63.5,53.34 64.77,54.61 76.2,54.61 77.47,53.34 U3.15 86.36,53.34 87.63,54.61 99.06,54.61 v101.6,57.15 105.41,60.96 130.81,60.96 132.08,59.69 U4.30 | R9.2 37.78,44.45 v44.45,44.45 | LED20.A 110.71,11.21 111.76,10.16 v111.76,8.89 X10.4
  Bottom 0.4: M1.25 44.45,3.81 v44.45,44.45 v44.45,53.34 | M2.10 132.08,73.66 U4.30 | v101.6,57.15 101.6,17.78 110.49,8.89 v111.76,8.89
D4  (via drill 0.5)
  Top 0.4: v43.18,50.8 U2.16 57.15,52.07 74.93,52.07 76.2,50.8 U3.16 86.36,50.8 87.63,52.07 97.79,52.07 v100.33,54.61 102.87,57.15 133.35,57.15 U4.29 | v43.18,40.64 R10.2 | LED21.A 108.17,11.21 109.22,10.16 v109.22,8.89 X10.5
  Bottom 0.4: M1.26 v43.18,40.64 v43.18,50.8 | M2.11 134.62,73.66 U4.29 | v100.33,54.61 100.33,17.78 v109.22,8.89
D5  (via drill 0.5)
  Top 0.4: v41.91,48.26 U2.17 63.5,48.26 64.77,49.53 74.93,49.53 76.2,48.26 U3.17 86.36,48.26 87.63,49.53 97.79,49.53 v99.06,50.8 102.87,54.61 133.35,54.61 U4.28 | R11.2 v41.91,38.1 | LED22.A 105.63,11.21 v106.68,10.16 106.68,8.89 X10.6
  Bottom 0.4: M1.27 41.91,3.81 v41.91,38.1 v41.91,48.26 | M2.12 137.16,73.66 U4.28 | v99.06,50.8 99.06,17.78 v106.68,10.16
D6  (via drill 0.5)
  Top 0.4: v40.64,45.72 U2.18 63.5,45.72 64.77,46.99 74.93,46.99 76.2,45.72 U3.18 86.36,45.72 87.63,46.99 v97.79,46.99 102.87,52.07 133.35,52.07 U4.27 | v40.64,35.56 R12.2 | LED23.A 103.09,11.21 v104.14,10.16 104.14,8.89 X10.7
  Bottom 0.4: M1.28 v40.64,35.56 v40.64,45.72 | M2.13 139.7,73.66 U4.27 | v97.79,46.99 97.79,17.78 104.14,11.43 v104.14,10.16
D7  (via drill 0.5)
  Top 0.4: v39.37,43.18 U2.19 63.5,43.18 64.77,44.45 74.93,44.45 76.2,43.18 U3.19 86.36,43.18 87.63,44.45 v96.52,44.45 97.79,44.45 102.87,49.53 133.35,49.53 U4.26 | v39.37,33.02 R13.2 | LED24.A 100.55,11.21 v101.6,10.16 X10.8
  Bottom 0.4: M1.29 39.37,3.81 v39.37,33.02 v39.37,43.18 | M2.14 140.97,74.93 140.97,59.05 141.6,58.42 U4.26 | v96.52,44.45 96.52,17.78 101.6,12.7 v101.6,10.16
EEPROM_!CS  (via drill 0.5)
  Top 0.4: v62.23,55.88 62.23,56.93 LED28.C 62.01,57.37 60.96,58.42 58.42,58.42 SJ2.2
  Bottom 0.4: v62.23,55.88 62.23,46.99 U2.20
EEPROM_!OE  (1 unrouted)
EEPROM_!WE  (via drill 0.5)
  Top 0.4: U2.27 54.61,22.86 53.34,24.13 v33.02,24.13 | v33.02,21.59 v29.21,21.59
  Bottom 0.4: v33.02,24.13 v33.02,21.59 | M1.39 26.67,3.81 26.67,19.05 v29.21,21.59
GND  (via drill 0.5)
  Top 0.4: C1.2 6.35,49.21 6.35,46.99 v3.81,44.45 | R53.2 113.35,29.21 v114.3,29.21 | R51.2 127.32,29.21 v128.27,29.21 | R56.2 141.29,29.21 v142.24,29.21 | R59.2 155.26,29.21 v156.21,29.21
  other vias: 20.32,66.04 20.32,60.96 27.94,12.7 49.53,11.43 13.97,78.74 22.86,78.74 31.75,78.74 38.1,78.74 52.07,11.43 72.39,78.74 69.85,78.74 74.93,97.79 5.08,93.98 20.32,50.8 38.1,52.07 38.1,48.26 8.89,59.05 3.81,58.42 3.81,33.02 95.25,16.51 99.06,2.54 54.61,2.54 121.92,2.54 121.28,9.53 98.42,9.53 93.98,78.74 104.14,78.74 116.84,78.74 142.24,78.74 124.46,46.99 149.86,46.99 154.94,54.61
  pour Bottom: -2.54,101.6 162.56,101.6 162.56,-2.54 -2.54,-2.54
  pour Top: -1.27,100.33 163.83,100.33 163.83,-3.81 -1.27,-3.81
HALT_BTN  (via drill 0.5)
  Top 0.4: X7.2 X7.1 | M1.40 25.4,6.35 27.94,8.89 v49.53,8.89
  Bottom 0.4: v49.53,8.89 52.07,8.89 53.34,7.62 132.08,7.62 134.62,10.16 146.89,10.16 X7.1
HALT_LED  (via drill 0.5)
  Top 0.4: M1.41 26.67,3.81 26.67,6.35 27.94,7.62 v49.53,7.62 | v144.78,8.89 144.78,10.16 145.83,11.21 LED34.A
  Bottom 0.4: v49.53,7.62 52.07,7.62 53.34,6.35 142.24,6.35 v144.78,8.89
IRQB  (via drill 0.5)
  Top 0.4: R2.2 U1.4 16.51,60.96 22.86,54.61 38.1,54.61 46.99,63.5 71.12,63.5 77.47,69.85 85.09,69.85 90.17,64.77 v110.49,64.77 149.1,64.77 JP3.2 | LED27.C 125.95,11.21 127,10.16 v127,8.89 X5.2
  Bottom 0.4: M1.A13 6.35,12.7 10.16,16.51 10.16,57.15 13.97,60.96 U1.4 | v110.49,64.77 110.49,17.78 113.03,15.24 120.65,15.24 v127,8.89
LCD_CS  (via drill 0.5)
  Top 0.4: SJ7.2 68.58,95.25 71.12,95.25 72.17,94.2 LED31.A 73.44,92.71 v99.06,92.71
  Bottom 0.4: M2.6 v99.06,92.71
N$1
  Top 0.4: U1.33 R6.1
N$2
  Top 0.4: U1.32 R7.1
N$3
  Top 0.4: U1.31 R8.1
N$4
  Top 0.4: R9.1 U1.30
N$5
  Top 0.4: U1.29 R10.1
N$6
  Top 0.4: U1.28 R11.1
N$7
  Top 0.4: U1.27 R12.1
N$8
  Top 0.4: U1.26 R13.1
N$9
  Top 0.4: U5.8 X17.3
N$10
  Top 0.4: U5.9 X17.2
N$11  (via drill 0.5)
  Top 0.4: U3.22 v91.44,35.56 | SJ1.2 v91.44,17.78
  Bottom 0.4: v91.44,35.56 v91.44,17.78
N$12  (via drill 0.5)
  Top 0.4: U5.3 U5.4 | v62.23,59.69 SJ2.3
  Bottom 0.4: U5.4 39.37,74.93 39.37,60.96 40.64,59.69 v62.23,59.69 | U5.12 U5.3
N$13  (via drill 0.5)
  Top 0.4: v85.09,59.69 SJ4.3 | v85.09,74.93 74.93,74.93 73.66,73.66 44.45,73.66 43.18,74.93 U5.6
  Bottom 0.4: v85.09,74.93 v85.09,59.69
N$14  (via drill 0.5)
  Top 0.4: v100.33,60.96 SJ3.3 | v91.44,90.17 13.97,90.17 X3.1 U6.15
  Bottom 0.4: v91.44,90.17 100.33,81.28 v100.33,60.96
N$15  (via drill 0.5)
  Top 0.4: v21.59,93.34 JP4.2
  Bottom 0.4: U6.6 21.59,77.47 v21.59,93.34
N$16  (via drill 0.5)
  Top 0.4: v15.24,95.89 15.37,96.01 JP5.1
  Bottom 0.4: U5.11 38.1,91.44 35.56,93.98 22.86,93.98 22.23,94.61 16.51,94.61 v15.24,95.89
N$17  (via drill 0.5)
  Top 0.4: v19.05,93.34 JP6.2
  Bottom 0.4: U6.5 19.05,77.47 v19.05,93.34
N$18  (via drill 0.5)
  Top 0.4: U6.14 X3.2 15.24,88.9 v54.61,88.9 | U7.1 U7.2
  Bottom 0.4: v54.61,88.9 57.15,86.36 57.15,77.47 U7.1
N$19
  Top 0.4: U7.3 U7.4
N$20
  Top 0.4: U7.9 U7.10
  Bottom 0.4: U7.9 U7.6
N$21  (via drill 0.5)
  Top 0.4: SJ7.3 v72.39,96.52
  Bottom 0.4: U7.8 73.66,95.25 v72.39,96.52
N$22
  Top 0.4: LED1.C R21.1
N$23
  Top 0.4: LED2.C R22.1
N$24
  Top 0.4: LED3.C R23.1
N$25
  Top 0.4: LED4.C R24.1
N$26
  Top 0.4: LED5.C R25.1
N$27
  Top 0.4: LED6.C R26.1
N$28
  Top 0.4: LED7.C R27.1
N$29
  Top 0.4: LED8.C R28.1
N$30
  Top 0.4: LED9.C R29.1
N$31
  Top 0.4: LED10.C R30.1
N$32
  Top 0.4: LED11.C R31.1
N$33
  Top 0.4: LED12.C R32.1
N$34
  Top 0.4: LED13.C R33.1
N$35
  Top 0.4: LED14.C R34.1
N$36
  Top 0.4: LED15.C R35.1
N$37
  Top 0.4: LED16.C R36.1
N$38
  Top 0.4: LED17.C R37.1
N$39
  Top 0.4: LED18.C R38.1
N$40
  Top 0.4: LED19.C R39.1
N$41
  Top 0.4: LED20.C R40.1
N$42
  Top 0.4: LED21.C R41.1
N$43
  Top 0.4: LED22.C R42.1
N$44
  Top 0.4: LED23.C R43.1
N$45
  Top 0.4: LED24.C R44.1
N$46
  Top 0.4: R45.1 LED25.C
N$47
  Top 0.4: LED26.C 7.72,7.84 R46.1
N$48
  Top 0.4: R47.1 LED27.A
N$49
  Top 0.4: R14.1 LED28.A
N$50
  Top 0.4: R15.1 LED29.A
N$51
  Top 0.4: R16.1 LED30.A
N$52
  Top 0.4: U5.10 X17.1
N$53  (via drill 0.5)
  Top 0.4: JP5.2 v16.51,93.34
  Bottom 0.4: v16.51,93.34 16.51,77.47 U6.4
N$54
  Top 0.4: LED39.C 15.14,7.84 R60.1
N$55
  Top 0.4: JP3.1 154.94,60.45 U4.21
N$56
  Top 0.4: U6.12 X3.4
N$57
  Top 0.4: U6.11 X3.5
N$58
  Top 0.4: U6.13 X3.3
N$59
  Top 0.4: U6.10 X3.6
N$60
  Top 0.4: U6.9 X3.7
N$61
  Top 0.4: LED31.C R17.1
N$62
  Top 0.4: U7.11 X4.1
N$63
  Top 0.4: U7.12 X4.2
N$64
  Top 0.4: U7.13 X4.3
N$65
  Top 0.4: R18.1 LED32.A
N$66
  Top 0.4: LED33.C R19.1
N$67
  Top 0.4: LED34.C R20.1
N$68
  Top 0.4: U4.2 X11.2
N$69
  Top 0.4: U4.3 X11.3
N$70
  Top 0.4: U4.4 X11.4
N$71
  Top 0.4: U4.5 X11.5
N$72
  Top 0.4: U4.6 X11.6
N$73
  Top 0.4: U4.7 X11.7
N$74
  Top 0.4: U4.8 X11.8
N$75
  Top 0.4: U4.9 X11.9
N$76
  Top 0.4: U4.10 X8.1
N$77
  Top 0.4: U4.11 X8.2
N$78
  Top 0.4: U4.12 X8.3
N$79
  Top 0.4: U4.13 X8.4
N$80
  Top 0.4: U4.14 X8.5
N$81
  Top 0.4: U4.15 X8.6
N$82
  Top 0.4: U4.16 X8.7
N$83
  Top 0.4: U4.17 X8.8
N$84
  Top 0.4: X13.2 X13.1 106.68,24.41 106.68,25.72 | R52.2 106.68,25.72 | 106.68,25.72 R48.2
N$85
  Top 0.4: LED35.C 112.93,26.89 R53.1
N$86
  Top 0.4: R49.2 119.38,26.95 120.61,25.72 120.65,25.72 | R50.2 120.65,25.72 | 120.65,25.72 120.65,24.41 X14.1 X14.2
N$87
  Top 0.4: R51.1 126.9,26.89 LED36.C
N$88
  Top 0.4: R54.2 134.62,25.72 | 134.62,25.72 134.62,24.41 X15.1 X15.2 | 134.62,25.72 R55.2
N$89
  Top 0.4: R56.1 140.87,26.89 LED37.C
N$90
  Top 0.4: R57.2 148.59,25.72 | 148.59,25.72 148.59,24.41 X16.1 X16.2 | 148.59,25.72 R58.2
N$91
  Top 0.4: JP7.1 147.32,60.45 U4.24
N$92  (via drill 0.5)
  Top 0.4: R61.2 61.59,96.52 66.67,91.44 v90.17,91.44
  Bottom 0.4: v90.17,91.44 91.44,92.71 M2.3
N$95
  Top 0.4: LED38.C 154.84,26.89 R59.1
NMIB
  Top 0.4: R3.2 U1.6
  Bottom 0.4: M1.A14 6.35,10.16 11.43,15.24 11.43,53.34 13.97,55.88 U1.6
PHI2  (via drill 0.5)
  Top 0.4: v7.62,62.23 29.21,62.23 U1.37 31.75,62.23 v40.64,62.23 41.91,62.23 44.45,64.77 71.12,64.77 77.47,71.12 85.09,71.12 90.17,66.04 v115.57,66.04 v142.24,66.04 | U5.5 40.64,77.47 41.91,78.74 67.31,78.74 68.58,77.47 U7.5 | LED33.A 132.08,9.94 v132.08,8.89 X5.4
  Bottom 0.4: U4.25 142.24,60.96 v142.24,66.04 | M1.A11 6.35,17.78 7.62,19.05 v7.62,62.23 | U5.5 v40.64,62.23 | v132.08,8.89 123.19,17.78 116.84,17.78 115.57,19.05 v115.57,66.04
PIA_!CS
  Top 0.4: SJ3.2 96.52,59.69 98.84,59.69 LED30.C 103.92,62.23 148.59,62.23 149.86,60.96 U4.23
RAM_!CS  (via drill 0.5)
  Top 0.4: SJ4.2 81.28,58.42 83.6,58.42 LED29.C 85.09,56.93 v85.09,55.88
  Bottom 0.4: v85.09,55.88 85.09,46.99 U3.20
RDY
  Top 0.4: R1.2 9.84,66.04 | 9.84,66.04 9.84,64.96 JP1.2 | U1.2 9.84,66.04
RDY_BE  (via drill 0.5)
  Top 0.4: v5.08,64.77 JP1.1 | JP2.1 v38.1,57.15 | v38.1,73.66 6.35,73.66 v5.08,72.39
  Bottom 0.4: M1.A9 3.81,22.86 5.08,24.13 v5.08,64.77 v5.08,72.39 | v38.1,57.15 v38.1,73.66
RESB  (via drill 0.5)
  Top 0.4: v6.35,72.39 26.67,72.39 U1.40 R4.2 36.52,69.85 38.42,69.85 40.96,67.31 68.58,67.31 74.93,73.66 87.63,73.66 92.71,68.58 v113.03,68.58 v118.11,68.58 | X5.3 v129.54,8.89 129.54,10.16 128.49,11.21 LED32.C 128.27,12.7 129.54,13.97 133.63,13.97 X6.1 X6.2
  Bottom 0.4: U4.34 121.92,64.77 v118.11,68.58 | M1.A10 5.08,20.32 6.35,21.59 v6.35,72.39 | v113.03,68.58 113,68.55 113,26.64 111.76,25.4 111.76,19.05 114.3,16.51 121.92,16.51 v129.54,8.89
RWB  (via drill 0.5)
  Top 0.4: U4.22 151.45,59.37 151.45,60.64 148.59,63.5 v114.3,63.5 v107.95,63.5 90.17,63.5 v86.36,67.31 85.09,68.58 77.47,68.58 71.12,62.23 48.26,62.23 39.37,53.34 U1.34 22.86,53.34 19.05,57.15 v8.89,57.15 | X5.1 v124.46,8.89 124.46,10.16 123.41,11.21 LED25.A
  Bottom 0.4: M2.5 96.52,92.71 114.3,74.93 v114.3,63.5 | U3.27 81.28,25.4 81.28,31.75 86.36,36.83 v86.36,67.31 | M1.A12 6.35,15.24 8.89,17.78 v8.89,57.15 | v124.46,8.89 119.38,13.97 111.76,13.97 109.22,16.51 109.22,25.4 107.95,26.67 v107.95,63.5
SYNC  (via drill 0.5)
  Top 0.4: v10.16,11.43 LED26.A
  Bottom 0.4: M1.A15 6.35,7.62 v10.16,11.43 12.7,13.97 12.7,50.8 U1.7
ULED1
  Top 0.4: LED35.A 110.49,29.21 111.76,30.48 X12.7
ULED2
  Top 0.4: LED36.A 122.97,30.48 121.92,30.48 X12.5
ULED3
  Top 0.4: LED37.A 135.67,31.75 125.73,31.75 X12.3
ULED4
  Top 0.4: X12.1 128.27,34.29 147.1,34.29 LED38.A

### Text on the board
tPlace: !EN | GND | 5V | !E1 | !E2 | E3 | ADDRESS DECODING | LCD | Peripheral Demux: | 0 | 1 | 2 | 3 | 4 | 5 | 6 | 3B | 3A | 3Y | 4B | 4A | 4Y | 74x138 | 74x00 | 74x00 | MICROPROCESSOR | !VP | !RES | RDY | PHI2O | PHI1 | SOB | !IRQ | PHI2 | PERIPHERAL INTERFACE | 5V|CS1 | !IRQ | !ML | BE | EEPROM | RAM | !NMI | 28C256 | 62256 | SYNC | R!W | VDD | D0 | W65C22 | A0 | D1 | A1 | D2 | A2 | D3 | A3 | D4 | GND | A0 | A1 | A2 | A3 | A4 | A5 | A6 | A7 | B0 | B1 | B2 | B3 | B4 | B5 | B6 | B7 | G | 5V | A4 | D5 | A5 | D6 | A6 | D7 | B1 | D1 | B2 | D2 | B3 | D3 | B4 | D4 | A7 | A15 | A8 | A14 | A9 | A13 | A10 | A12 | 1 | 2 | 3 | 4 | A11 | VSS | W65C02 | ADDRESS | DATA | RESET | HALT/ / SINGLE STEP | SYNC | PWR | 15 | 14 | 13 | 12 | 11 | 10 | 9 | 8 | 7 | 6 | 5 | 4 | 3 | 2 | 1 | 0 | 7 | 6 | 5 | 4 | 3 | 2 | 1 | 0 | R!W | IRQ | RESET | PHI2 | RF-6502 | V1.0 | R. Fromm | 01-2021 | 5V | GND